# Altium project 0ALD488.PrjPcb
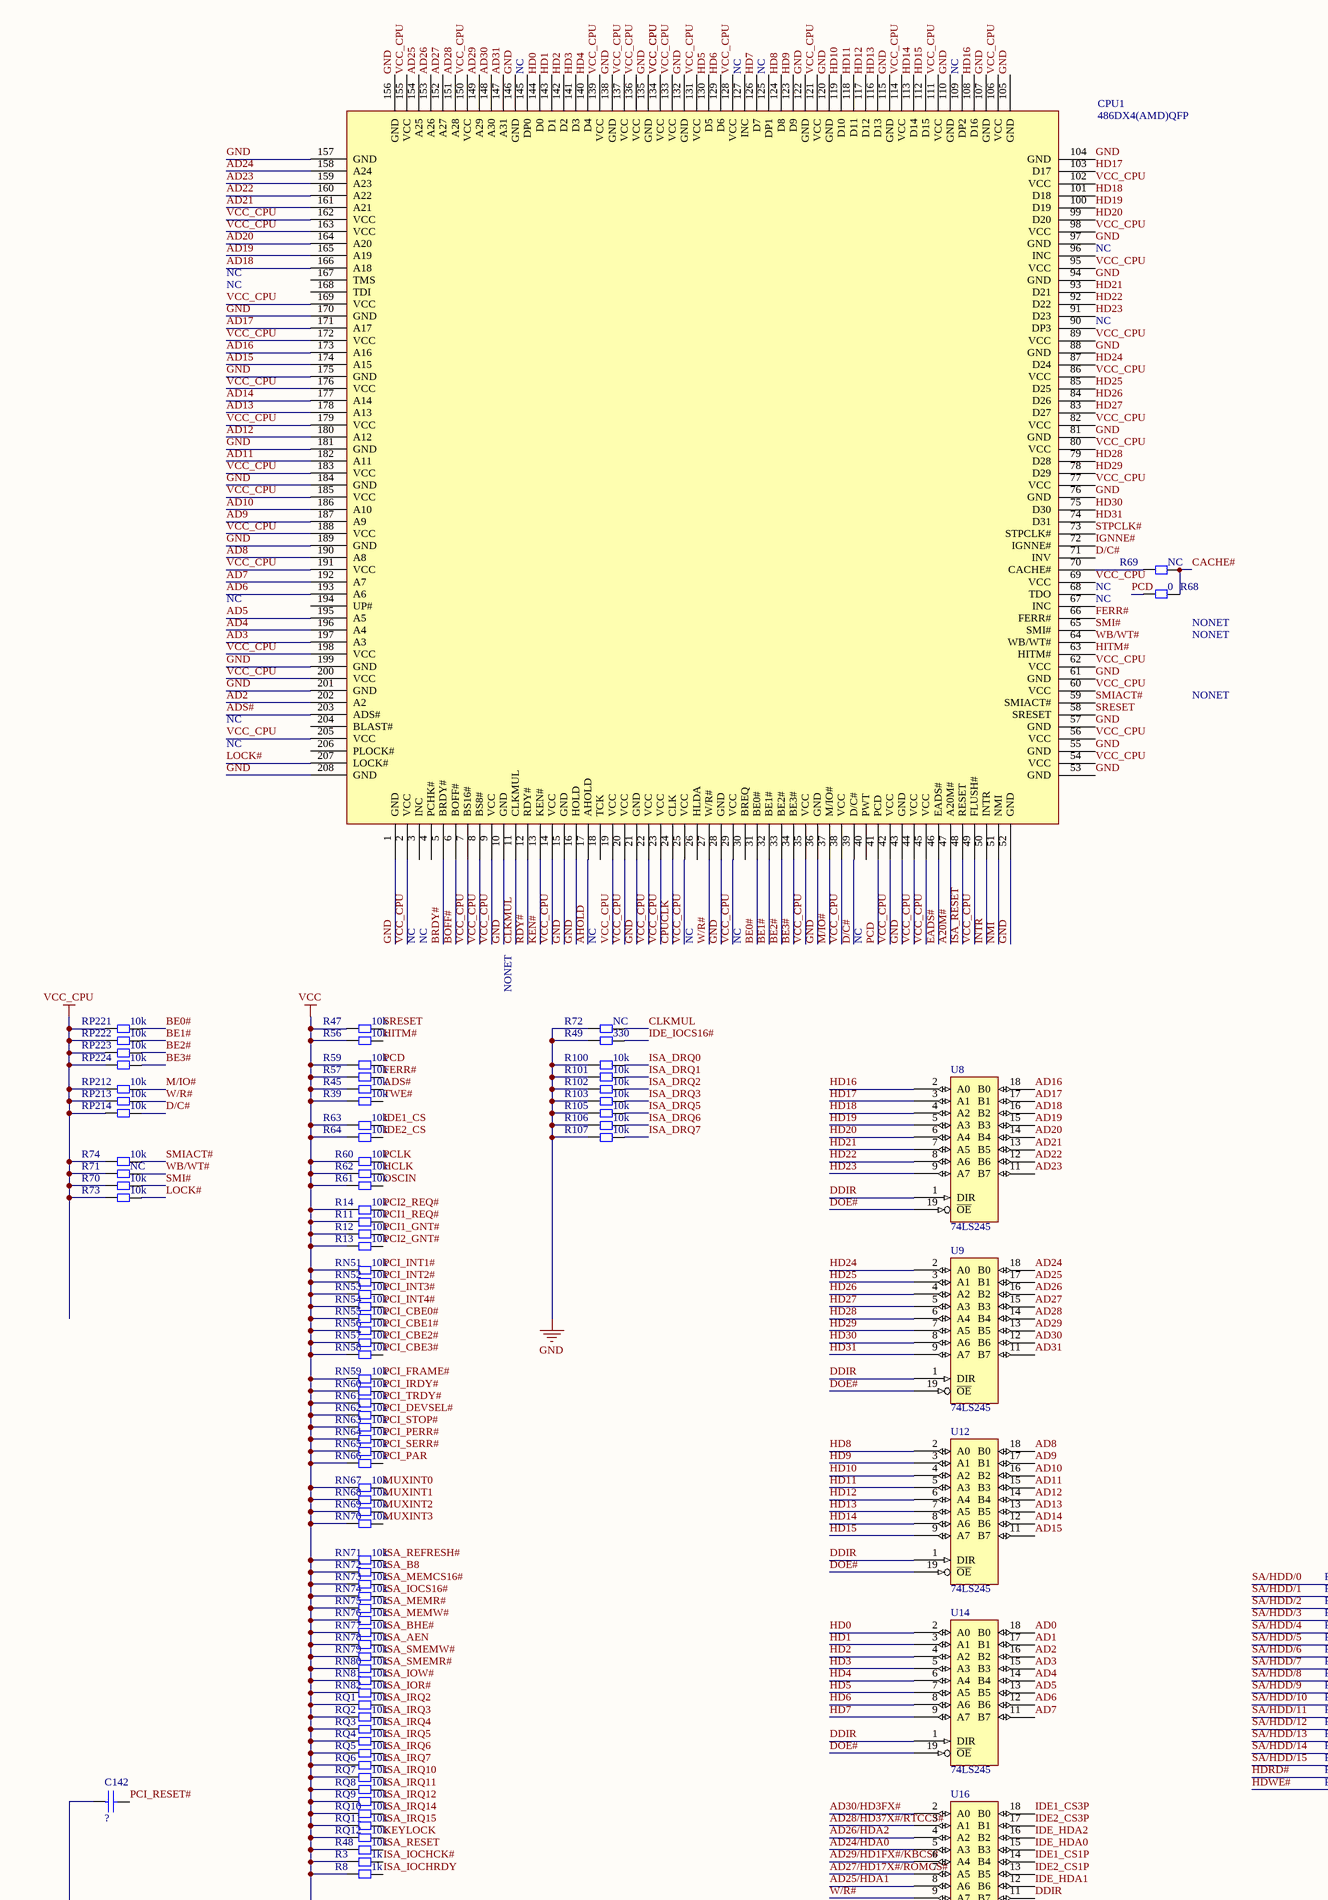
[diagram p0: Sheet1.SchDoc, top left]
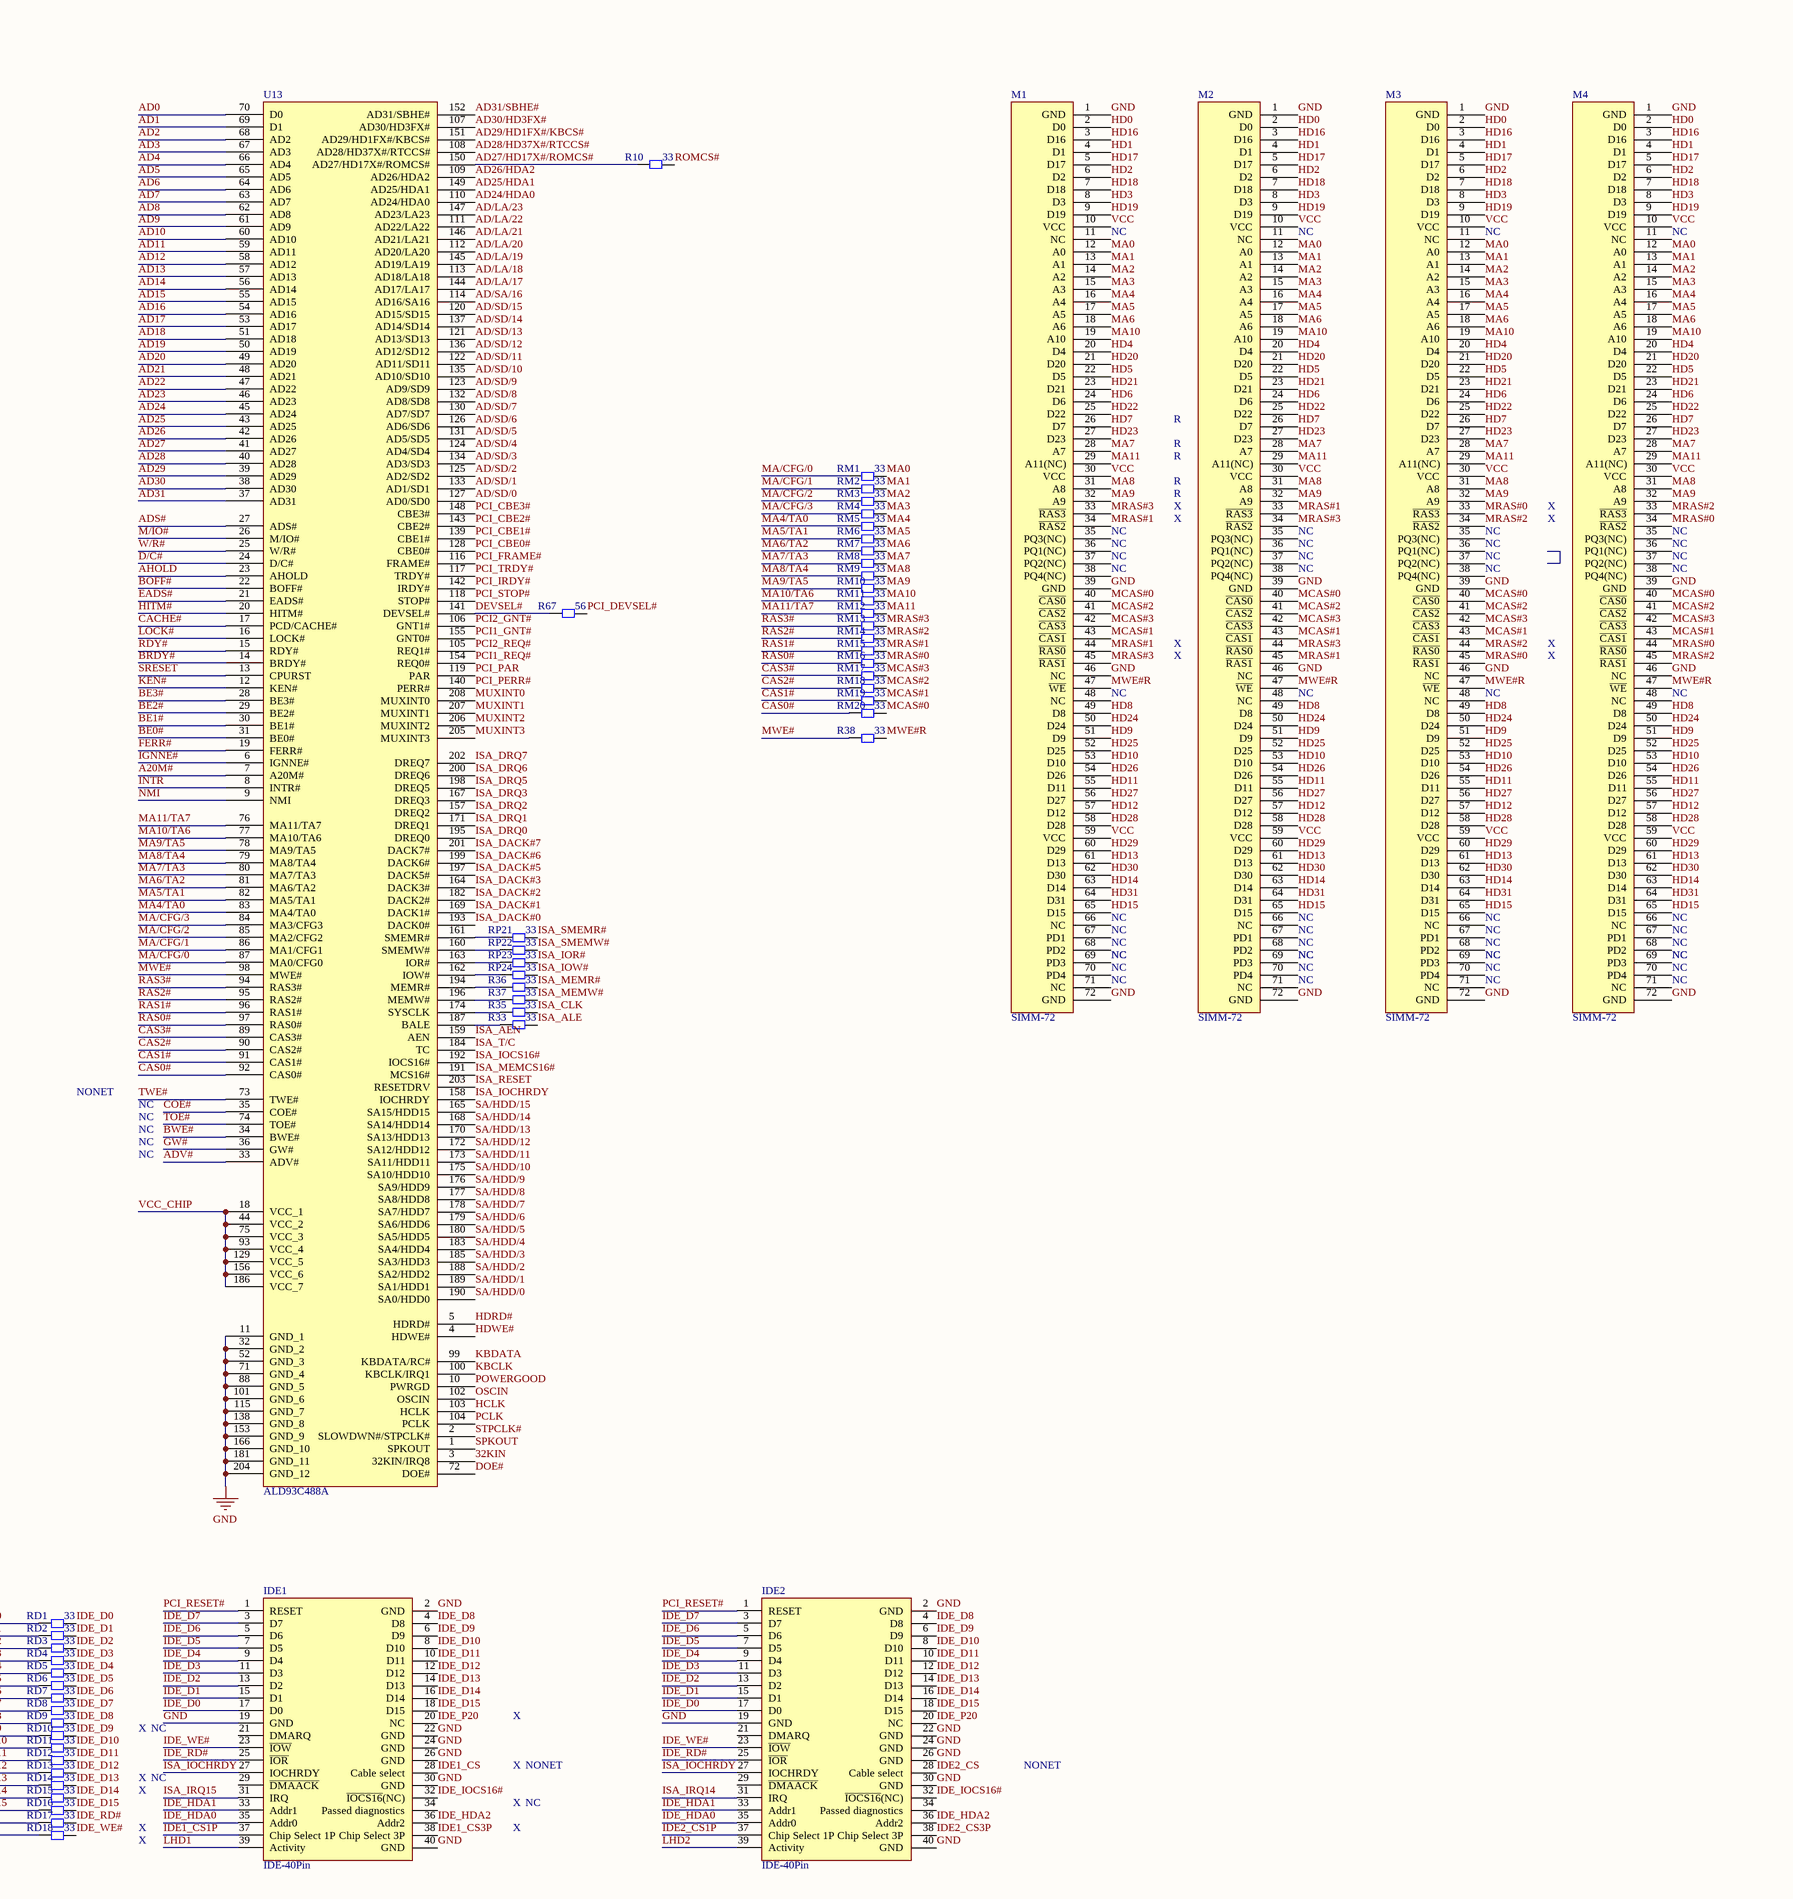
[diagram p1: Sheet1.SchDoc, top middle]
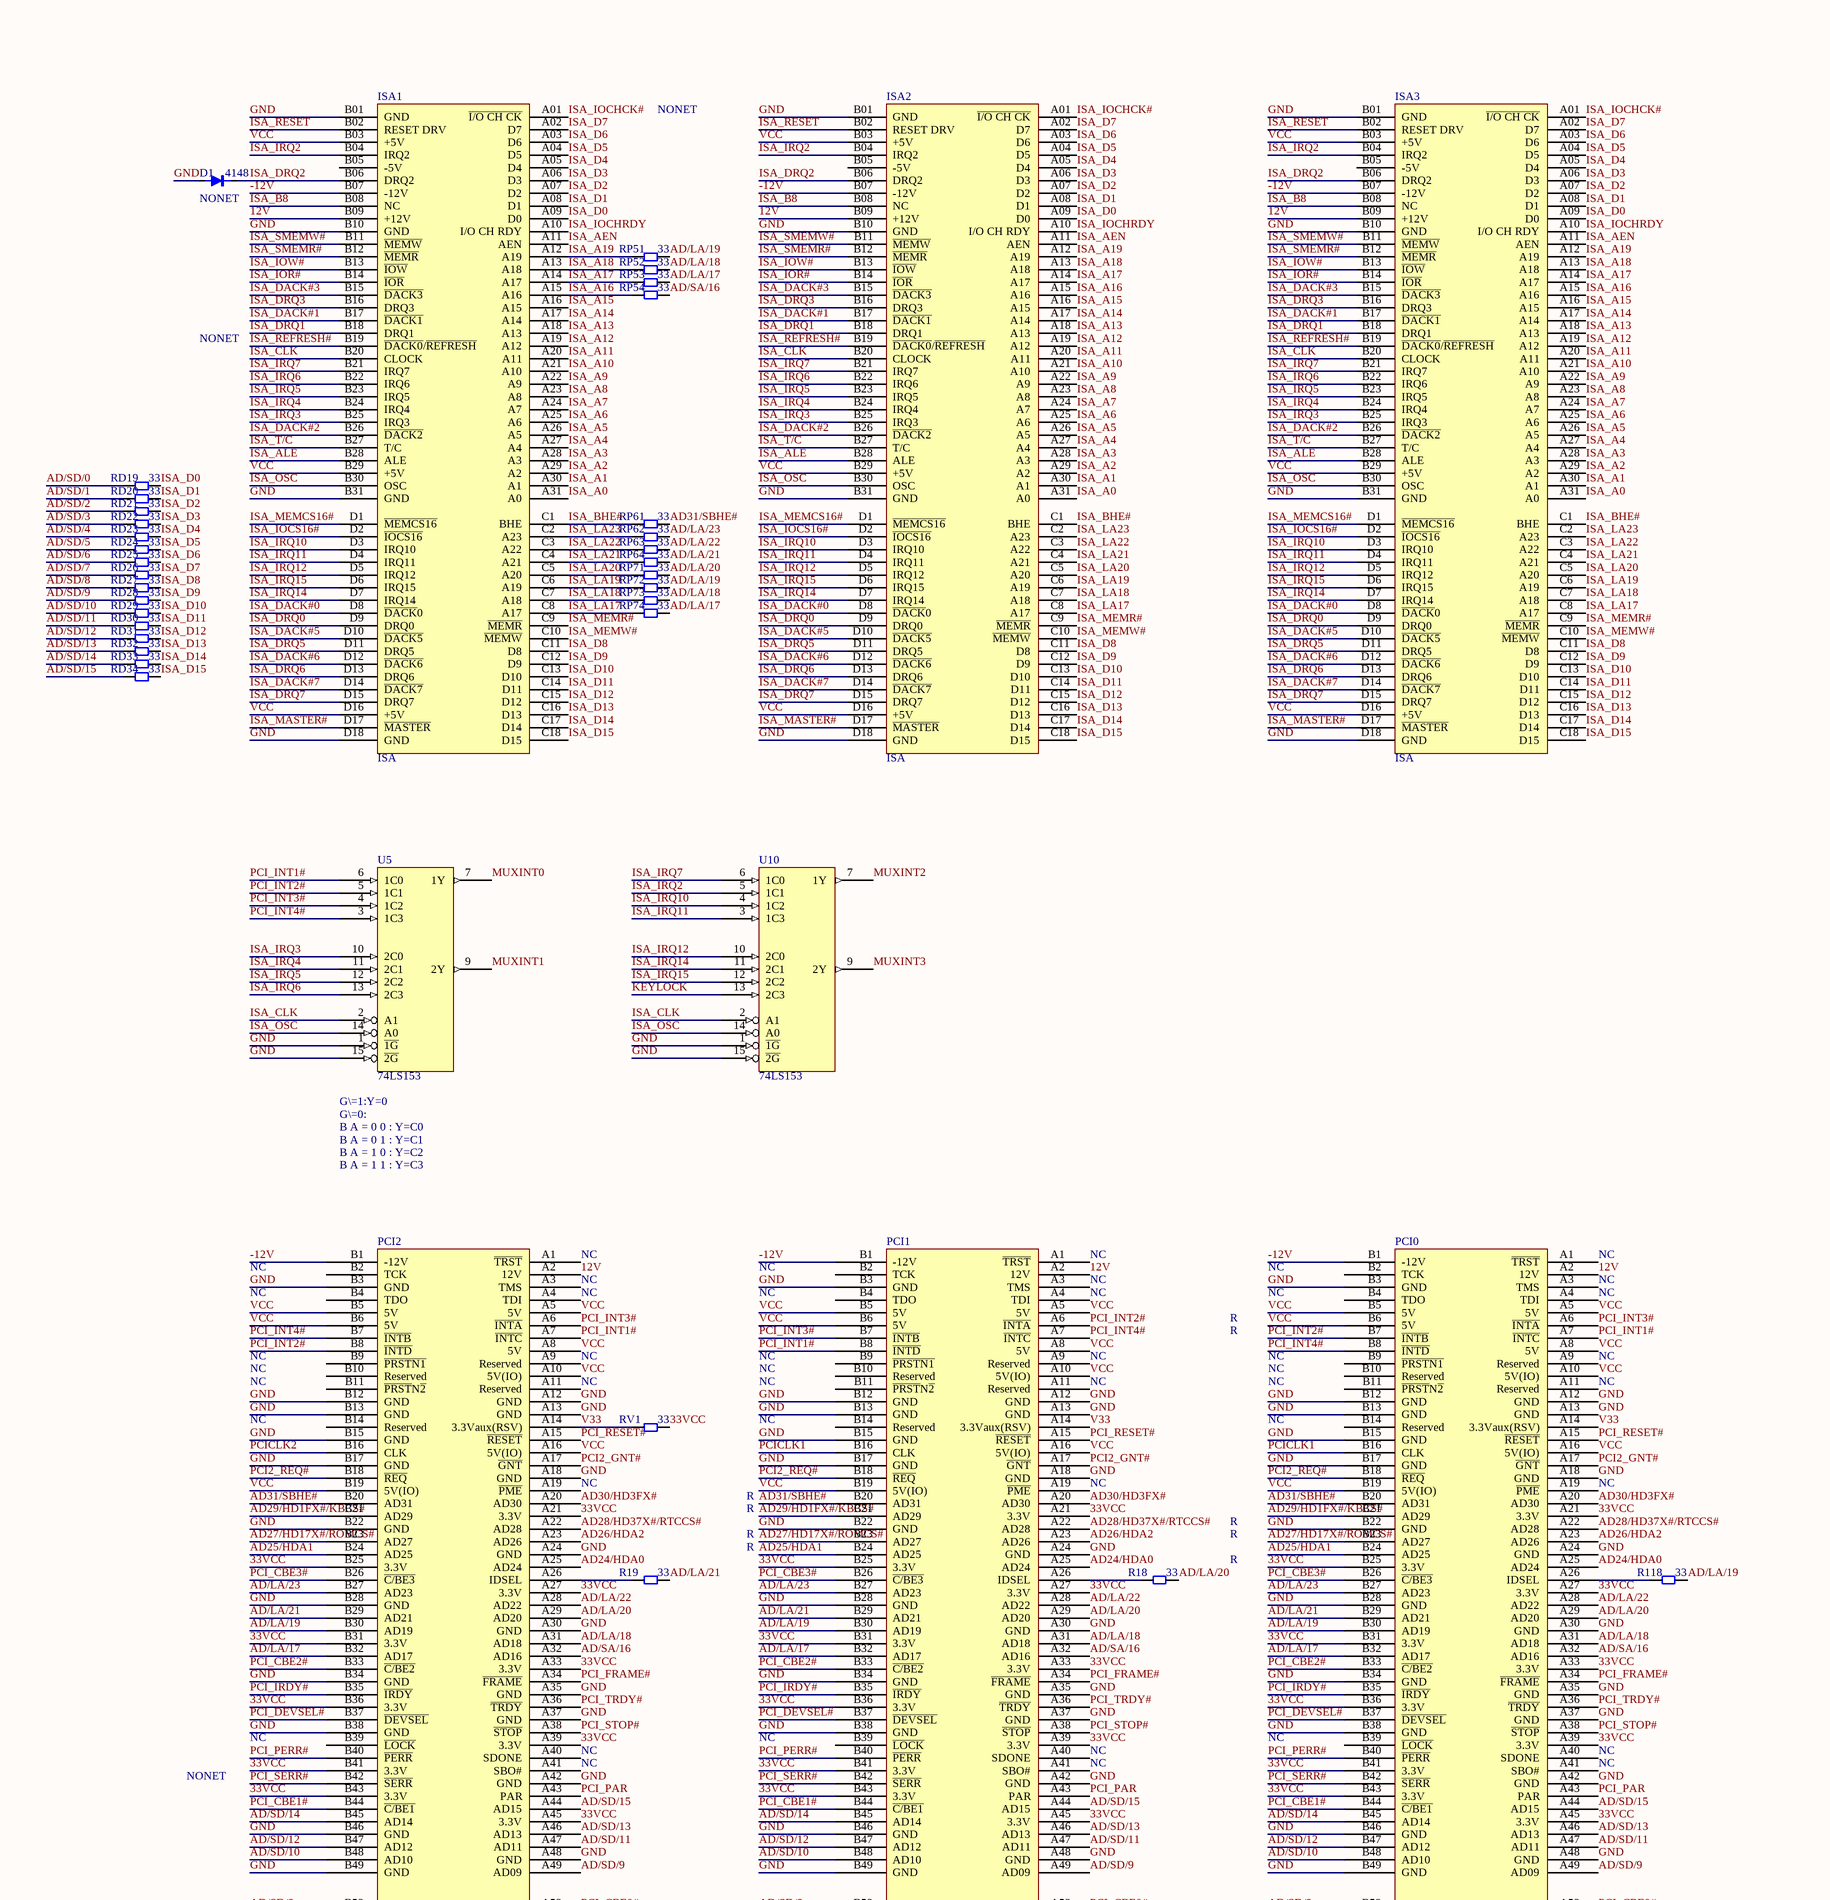
[diagram p2: Sheet1.SchDoc, top right]
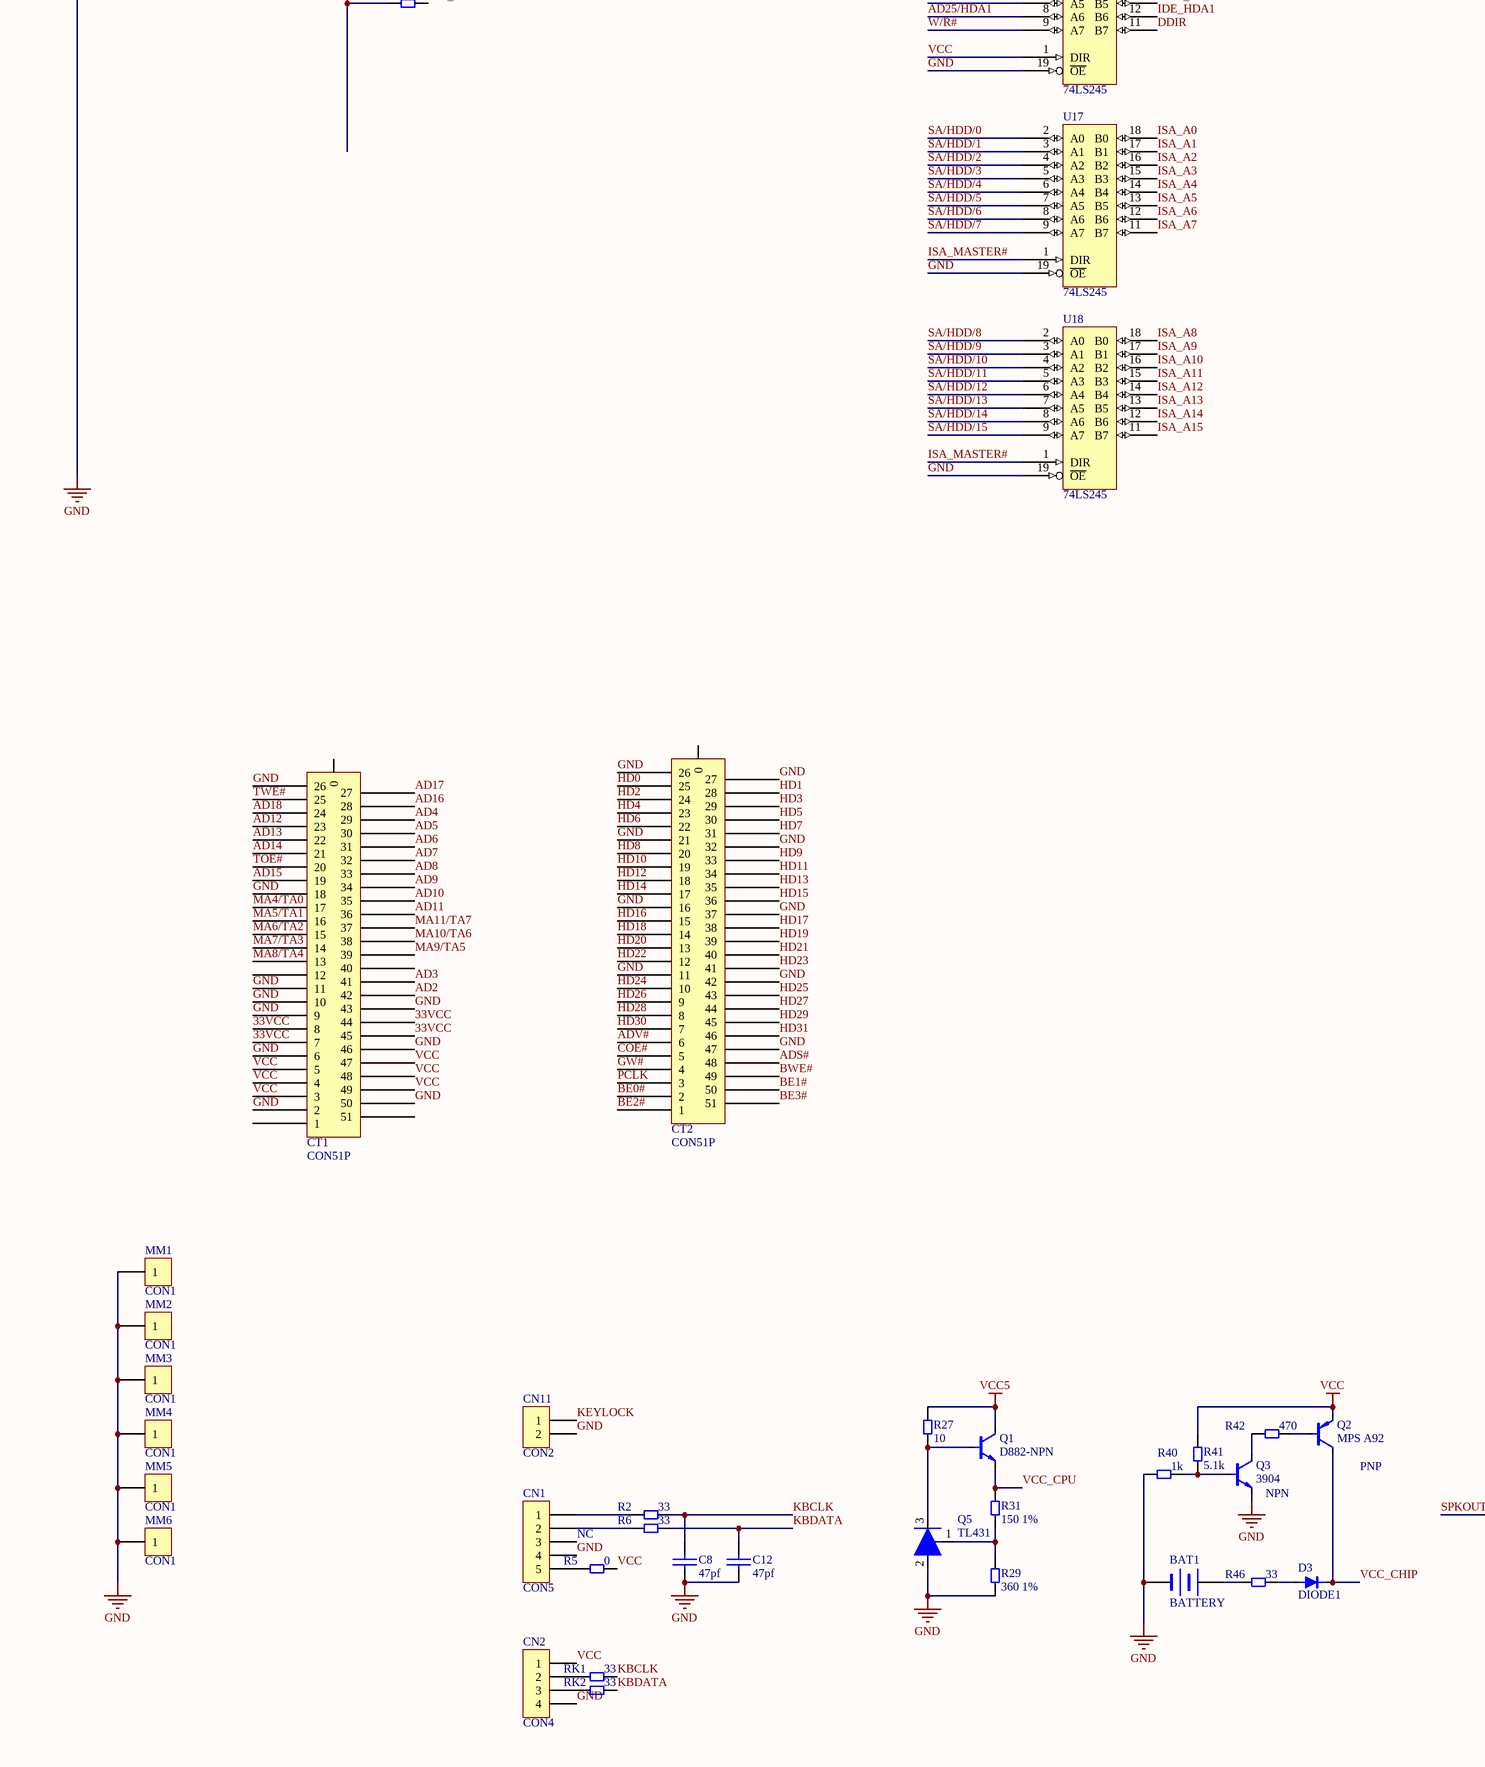
[diagram p3: Sheet1.SchDoc, bottom left]
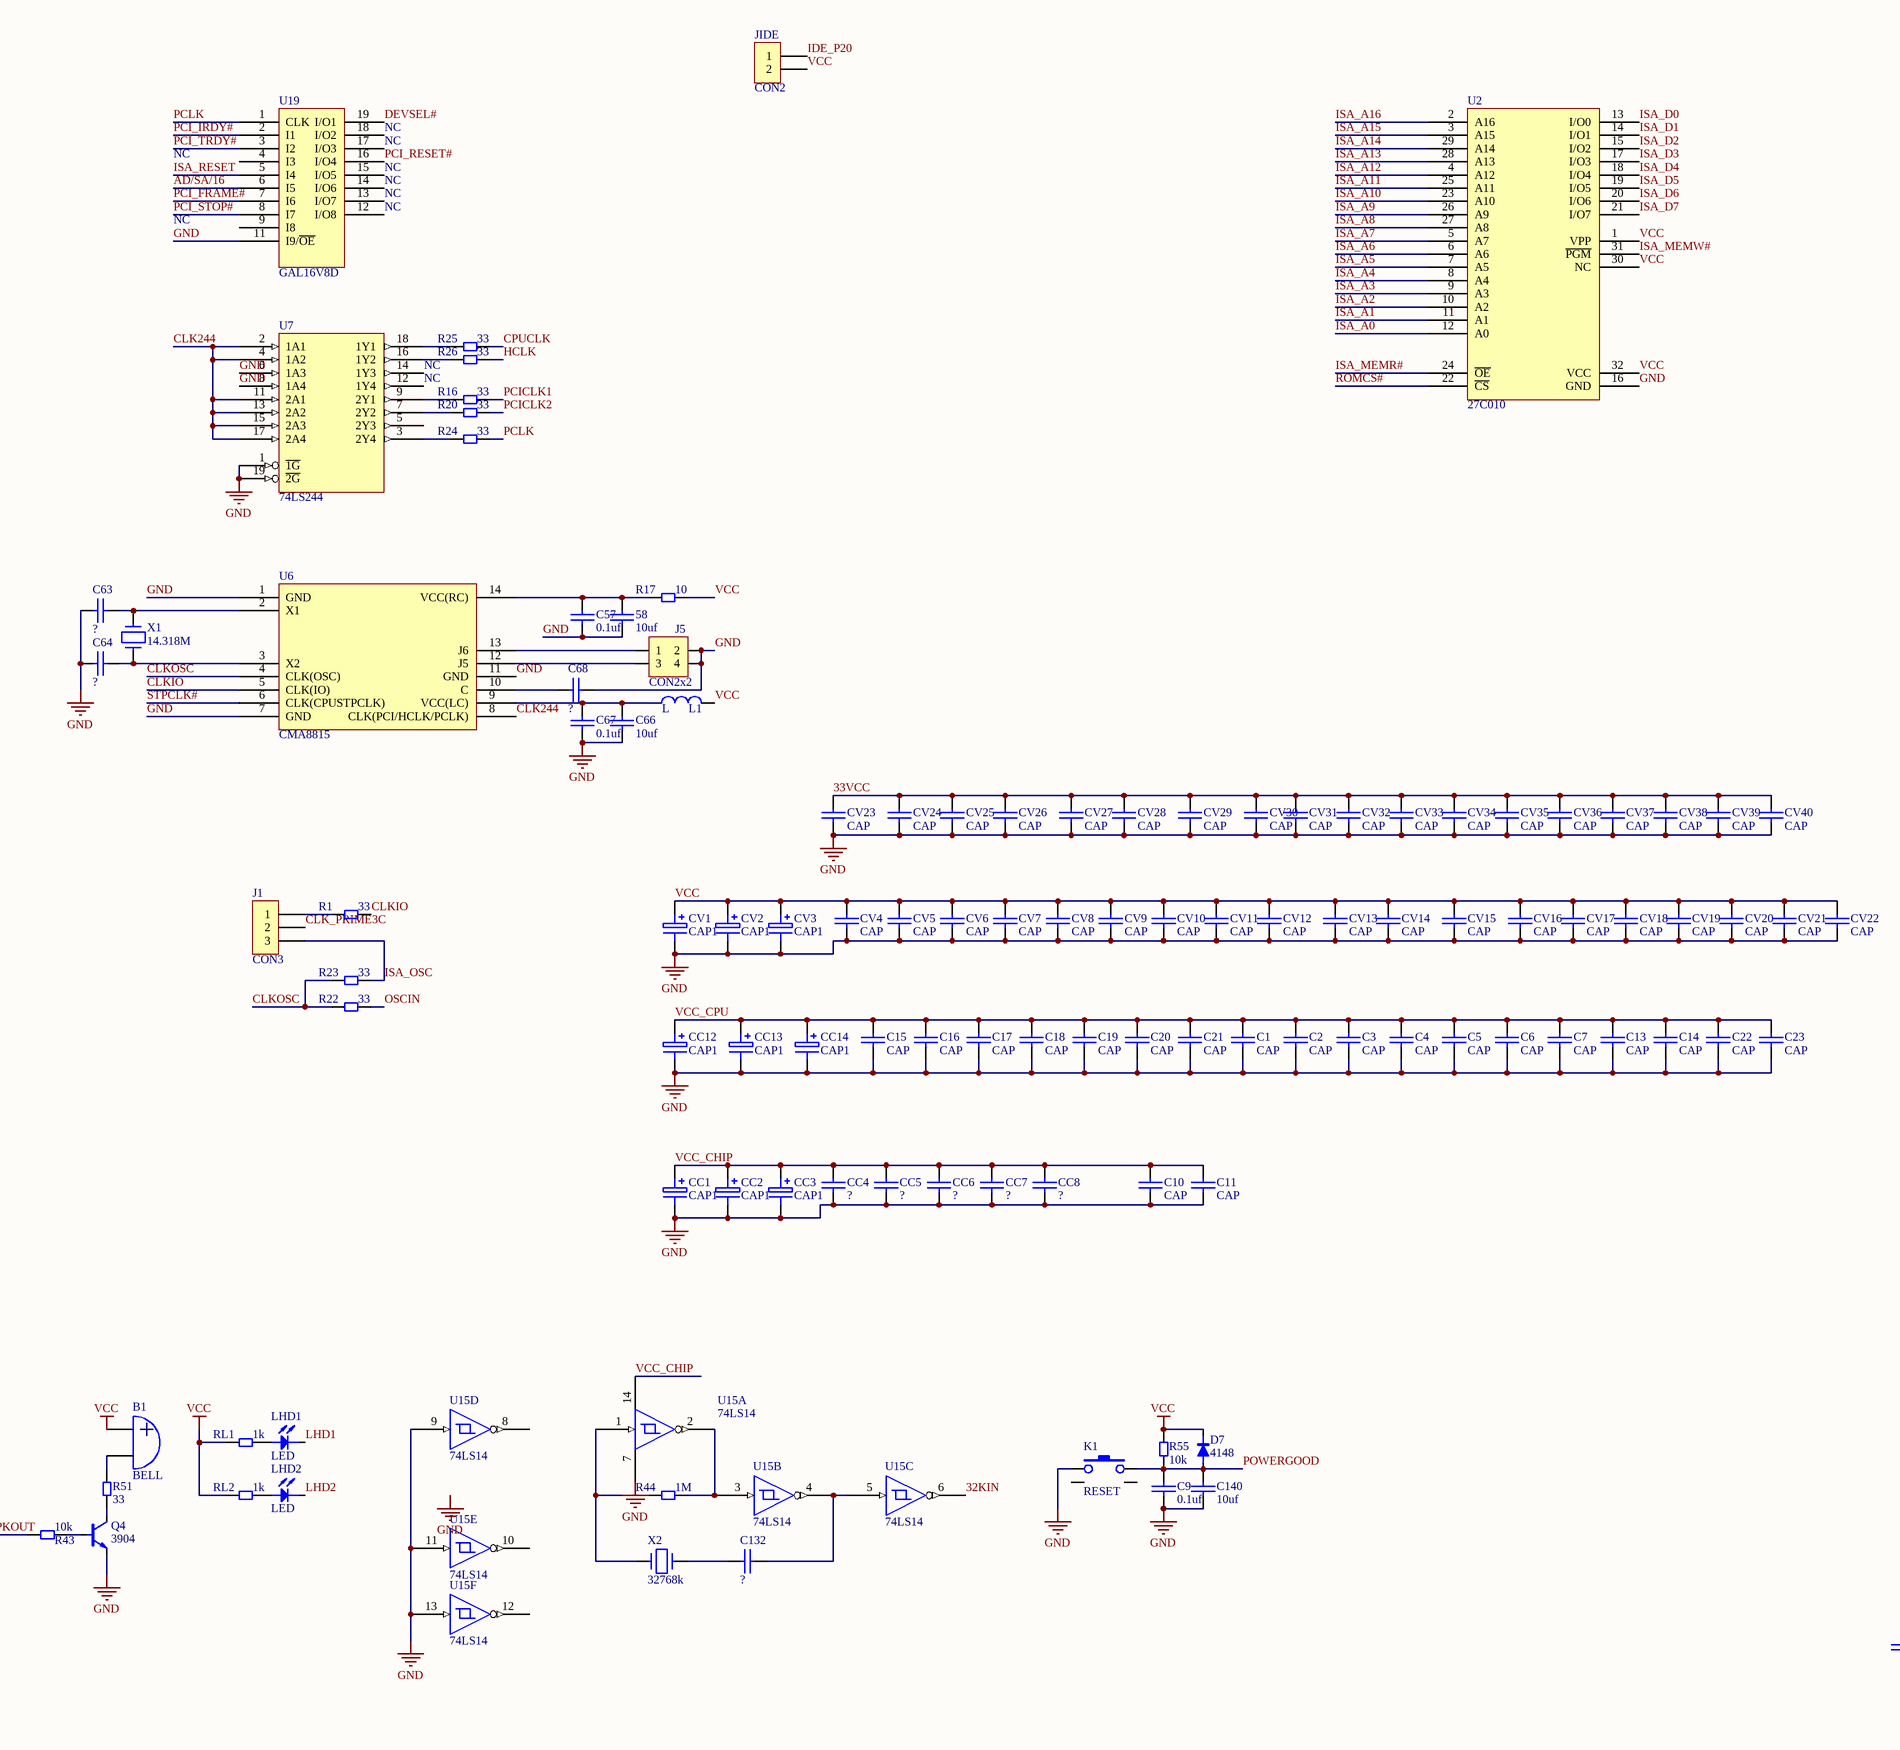
[diagram p4: Sheet1.SchDoc, bottom middle]
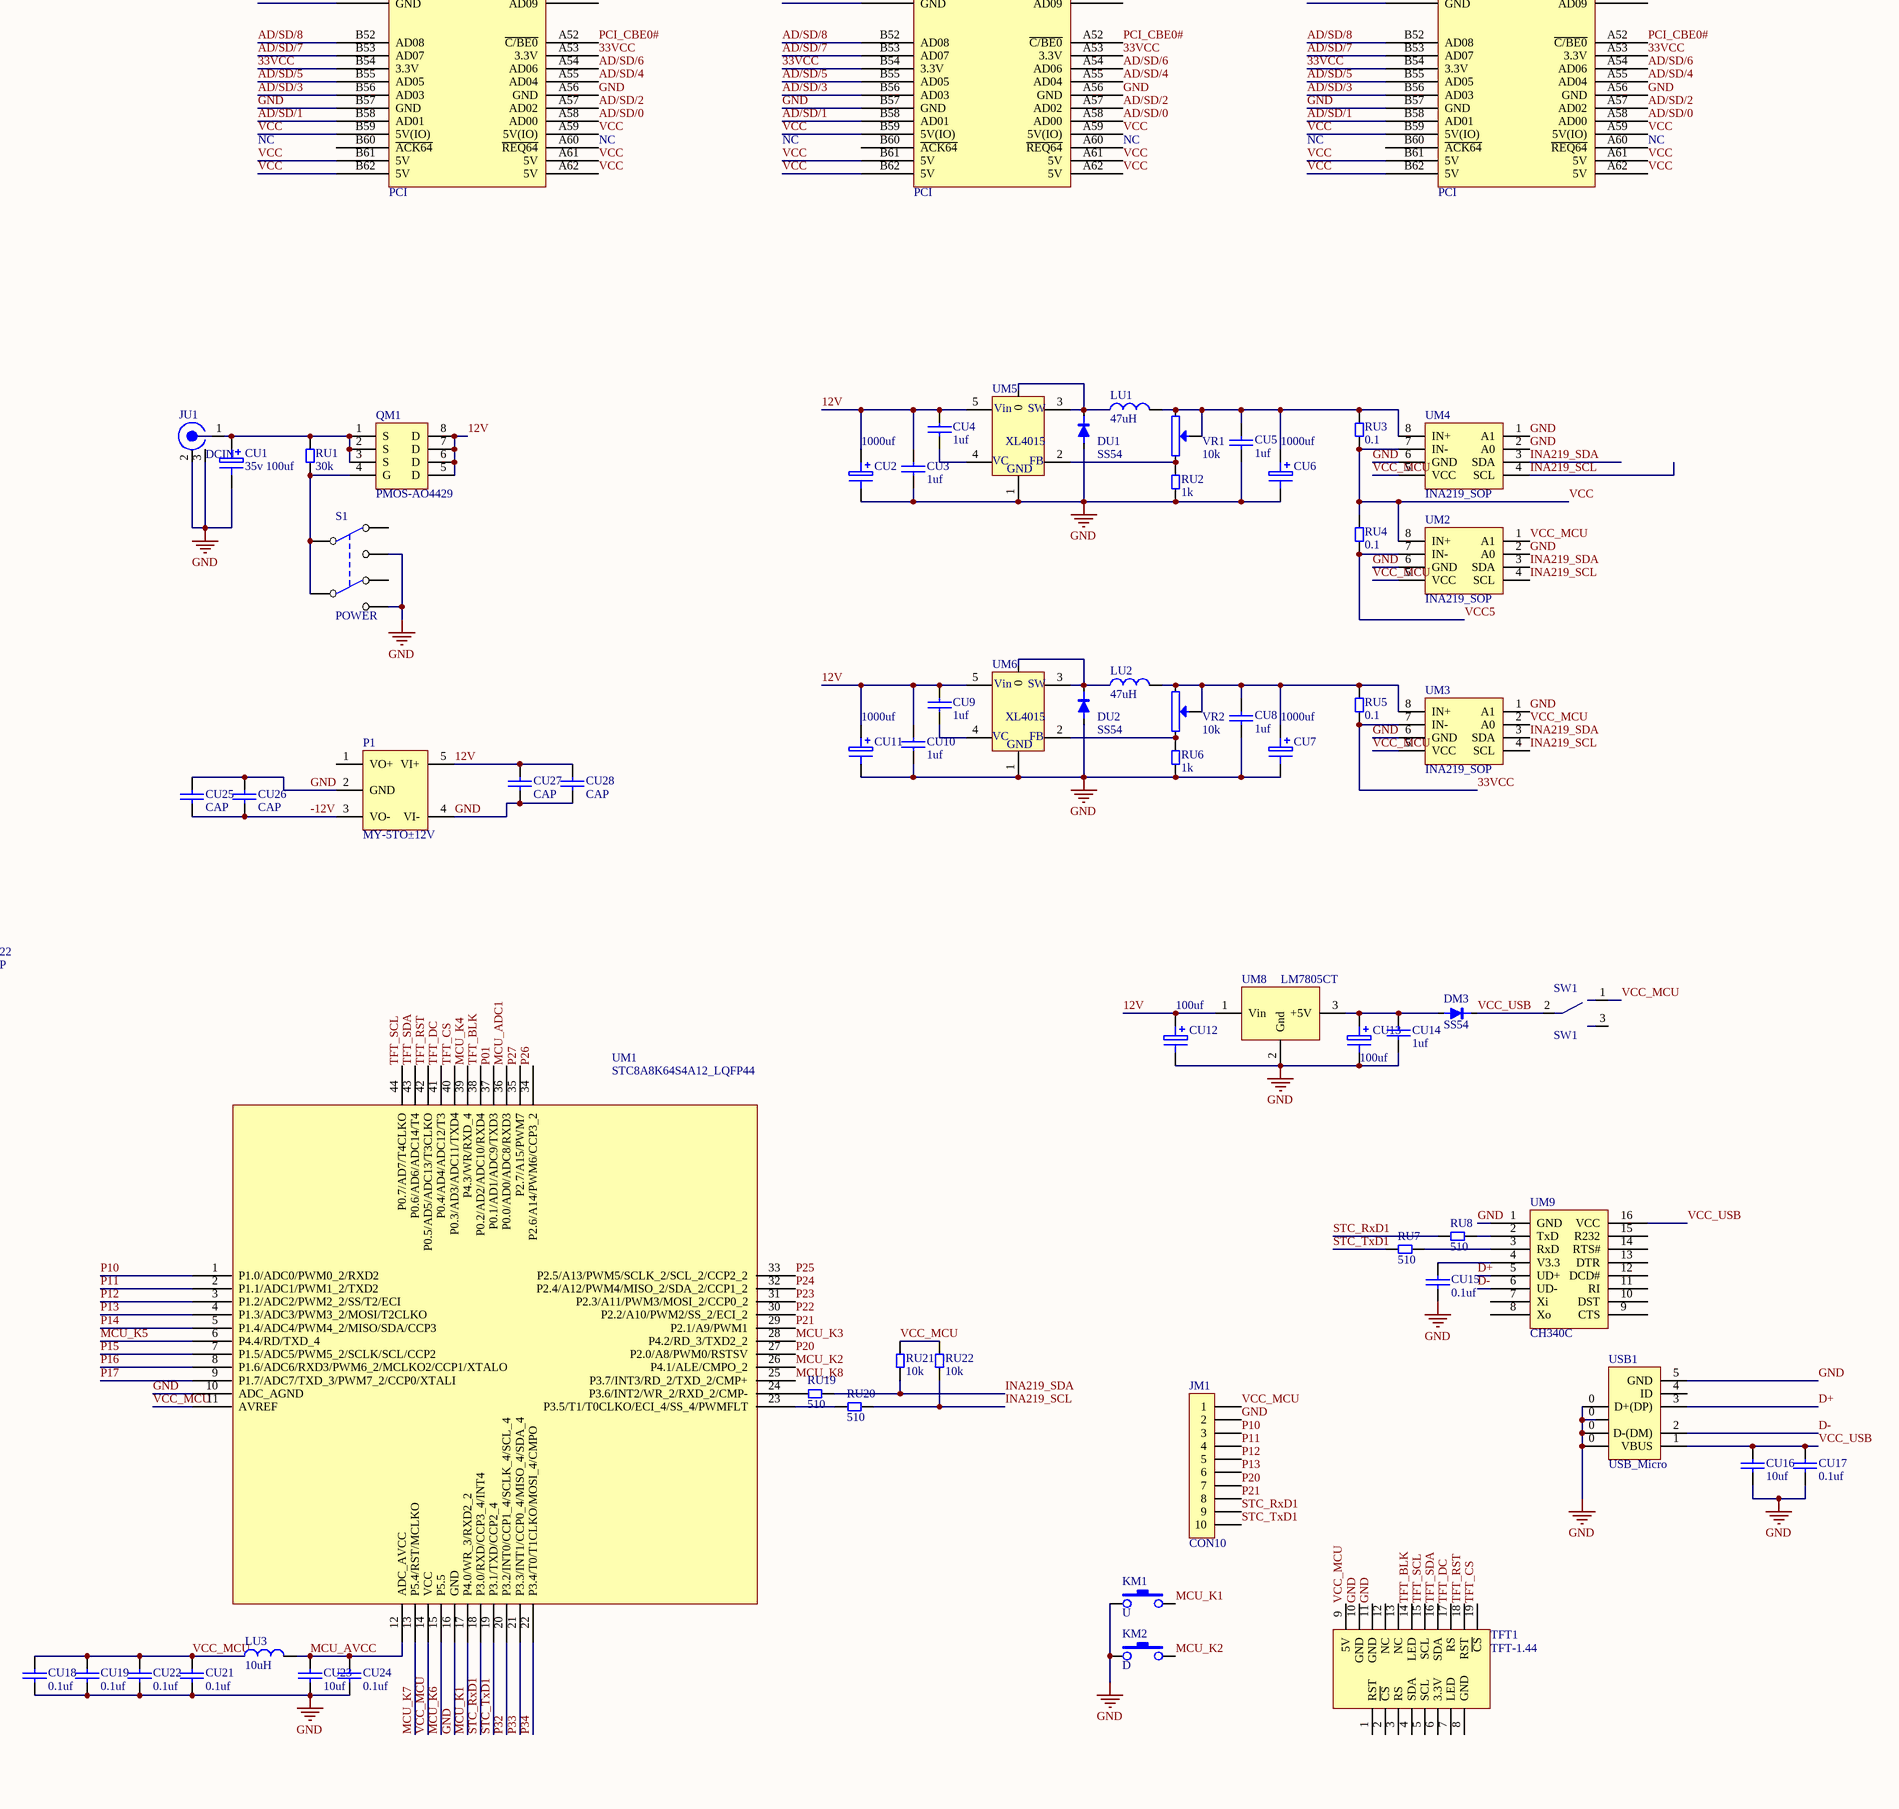
[diagram p5: Sheet1.SchDoc, bottom right]
1 sheet, 399 parts. Net scope: global (net labels, ports and power ports of the same name join across sheets).
Board file: PCB1.PcbDoc

## Sheet Sheet1.SchDoc
size 1016 x 762 mm; SheetNumber: 1; SheetTotal: 1

### Parts
58  10uf  [C0603]
B1  BELL  [bell]
BAT1  BATTERY  [BATTERY3]
C1  CAP  [C0603]
C2  CAP  [C0603]
C3  CAP  [C0603]
C4  CAP  [C0603]
C5  CAP  [C0603]
C6  CAP  [C0603]
C7  CAP  [C0603]
C8  47pf  [C0603]
C9  0.1uf  [C0603]
C10  CAP  [C0603]
C11  CAP  [C0603]
C12  47pf  [C0603]
C13  CAP  [C0603]
C14  CAP  [C0603]
C15  CAP  [C0603]
C16  CAP  [C0603]
C17  CAP  [C0603]
C18  CAP  [C0603]
C19  CAP  [C0603]
C20  CAP  [C0603]
C21  CAP  [C0603]
C22  CAP  [C0603]
C23  CAP  [C0603]
C57  0.1uf  [C0603]
C63  ?  [C0603]
C64  ?  [C0603]
C66  10uf  [C0603]
C67  0.1uf  [C0603]
C68  ?  [C0603]
C132  ?  [C0603]
C140  10uf  [C0603]
C142  ?  [C0603]
CC1  CAP1  [RB.1/.2]
CC2  CAP1  [RB.1/.2]
CC3  CAP1  [RB.1/.2]
CC4  ?  [C0603]
CC5  ?  [C0603]
CC6  ?  [C0603]
CC7  ?  [C0603]
CC8  ?  [C0603]
CC12  CAP1  [RB.1/.2]
CC13  CAP1  [RB.1/.2]
CC14  CAP1  [RB.1/.2]
CN1  CON5  [PS2-XT-5]
CN2  CON4  [XH2.54-4]
CN11  CON2  [SIP2]
CPU1  486DX4(AMD)QFP  [QFP208]
CT1  CON51P  [BTB1.0-51P]
CT2  CON51P  [BTB1.0-51P]
CU1  35v 100uf  [CD6]
CU2  1000uf  [SMD-EC-F10]
CU3  1uf  [C0603]
CU4  1uf  [C0603]
CU5  1uf  [C0603]
CU6  1000uf  [SMD-EC-F10]
CU7  1000uf  [SMD-EC-F10]
CU8  1uf  [C0603]
CU9  1uf  [C0603]
CU10  1uf  [C0603]
CU11  1000uf  [SMD-EC-F10]
CU12  100uf  [SMD-EC-F6.3]
CU13  100uf  [SMD-EC-F6.3]
CU14  1uf  [C0603]
CU15  0.1uf  [C0603]
CU16  10uf  [C0603]
CU17  0.1uf  [C0603]
CU18  0.1uf  [C0603]
CU19  0.1uf  [C0603]
CU21  0.1uf  [C0603]
CU22  0.1uf  [C0603]
CU23  10uf  [C0603]
CU24  0.1uf  [C0603]
CU25  CAP  [C0603]
CU26  CAP  [C0603]
CU27  CAP  [C0603]
CU28  CAP  [C0603]
CV1  CAP1  [RB.1/.2]
CV2  CAP1  [RB.1/.2]
CV3  CAP1  [RB.1/.2]
CV4  CAP  [C0603]
CV5  CAP  [C0603]
CV6  CAP  [C0603]
CV7  CAP  [C0603]
CV8  CAP  [C0603]
CV9  CAP  [C0603]
CV10  CAP  [C0603]
CV11  CAP  [C0603]
CV12  CAP  [C0603]
CV13  CAP  [C0603]
CV14  CAP  [C0603]
CV15  CAP  [C0603]
CV16  CAP  [C0603]
CV17  CAP  [C0603]
CV18  CAP  [C0603]
CV19  CAP  [C0603]
CV20  CAP  [C0603]
CV21  CAP  [C0603]
CV22  CAP  [C0603]
CV23  CAP  [C0603]
CV24  CAP  [C0603]
CV25  CAP  [C0603]
CV26  CAP  [C0603]
CV27  CAP  [C0603]
CV28  CAP  [C0603]
CV29  CAP  [C0603]
CV30  CAP  [C0603]
CV31  CAP  [C0603]
CV32  CAP  [C0603]
CV33  CAP  [C0603]
CV34  CAP  [C0603]
CV35  CAP  [C0603]
CV36  CAP  [C0603]
CV37  CAP  [C0603]
CV38  CAP  [C0603]
CV39  CAP  [C0603]
CV40  CAP  [C0603]
D1  4148  [DO-214A(SMA)]
D3  DIODE1  [DO-214A(SMA)]
D7  4148  [DO-214A(SMA)]
DM3  SS54  [DO-214A(SMA)]
DU1  SS54  [DO-214A(SMA)]
DU2  SS54  [DO-214A(SMA)]
IDE1  IDE-40Pin  [MY-IDE40]
IDE2  IDE-40Pin  [MY-IDE40]
ISA1  ISA  [MY-ISA16-98]
ISA2  ISA  [MY-ISA16-98]
ISA3  ISA  [MY-ISA16-98]
J1  CON3  [SIP3]
J5  CON2x2  [SIP2x2(2.54)]
JIDE  CON2  [SIP2]
JM1  CON10  [sip10]
JU1  DCIN  [DC5.5-2.5]
K1  RESET  [AN66]
KM1  U  [AN66]
KM2  D  [AN66]
L1  L  [L0603]
LHD1  LED  [LED0603]
LHD2  LED  [LED0603]
LU1  47uH  [L1260]
LU2  47uH  [L1260]
LU3  10uH  [L0805]
M1  SIMM-72  [MY-SIMM72]
M2  SIMM-72  [MY-SIMM72]
M3  SIMM-72  [MY-SIMM72]
M4  SIMM-72  [MY-SIMM72]
MM1  CON1  [M3]
MM2  CON1  [M3]
MM3  CON1  [M3]
MM4  CON1  [M3]
MM5  CON1  [M3]
MM6  CON1  [M3]
P1  MY-5TO±12V  [MY-5TO±12]
PCI0  PCI  [PCI]
PCI1  PCI  [PCI]
PCI2  PCI  [PCI]
Q1  D882-NPN  [TO-126A]
Q2  MPS A92  [TO-92]
Q3  3904  [SOT23]
Q4  3904  [SOT23]
Q5  TL431  [TO92]
QM1  PMOS-AO4429  [SO-8]
R1  33  [R0603]
R2  33  [R0603]
R3  1k  [R0603]
R5  0  [R0603]
R6  33  [R0603]
R8  1k  [R0603]
R10  33  [R0603]
R11  10k  [R0603]
R12  10k  [R0603]
R13  10k  [R0603]
R14  10k  [R0603]
R16  33  [R0603]
R17  10  [R0603]
R18  33  [R0603]
R19  33  [R0603]
R20  33  [R0603]
R22  33  [R0603]
R23  33  [R0603]
R24  33  [R0603]
R25  33  [R0603]
R26  33  [R0603]
R27  10  [R0603]
R29  360 1%  [R0603]
R31  150 1%  [R0603]
R33  33  [R0603]
R35  33  [R0603]
R36  33  [R0603]
R37  33  [R0603]
R38  33  [R0603]
R39  10k  [R0603]
R40  1k  [R0603]
R41  5.1k  [R0603]
R42  470  [R0603]
R43  10k  [R0603]
R44  1M  [R0603]
R45  10k  [R0603]
R46  33  [R0603]
R47  10k  [R0603]
R48  10k  [R0603]
R49  330  [R0603]
R51  33  [R0603]
R55  10k  [R0603]
R56  10k  [R0603]
R57  10k  [R0603]
R59  10k  [R0603]
R60  10k  [R0603]
R61  10k  [R0603]
R62  10k  [R0603]
R63  10k  [R0603]
R64  10k  [R0603]
R67  56  [R0603]
R68  0  [R0603]
R69  NC  [R0603]
R70  10k  [R0603]
R71  NC  [R0603]
R72  NC  [R0603]
R73  10k  [R0603]
R74  10k  [R0603]
R100  10k  [R0603]
R101  10k  [R0603]
R102  10k  [R0603]
R103  10k  [R0603]
R105  10k  [R0603]
R106  10k  [R0603]
R107  10k  [R0603]
R118  33  [R0603]
RD1  33  [R0603]
RD2  33  [R0603]
RD3  33  [R0603]
RD4  33  [R0603]
RD5  33  [R0603]
RD6  33  [R0603]
RD7  33  [R0603]
RD8  33  [R0603]
RD9  33  [R0603]
RD10  33  [R0603]
RD11  33  [R0603]
RD12  33  [R0603]
RD13  33  [R0603]
RD14  33  [R0603]
RD15  33  [R0603]
RD16  33  [R0603]
RD17  33  [R0603]
RD18  33  [R0603]
RD19  33  [R0603]
RD20  33  [R0603]
RD21  33  [R0603]
RD22  33  [R0603]
RD23  33  [R0603]
RD24  33  [R0603]
RD25  33  [R0603]
RD26  33  [R0603]
RD27  33  [R0603]
RD28  33  [R0603]
RD29  33  [R0603]
RD30  33  [R0603]
RD31  33  [R0603]
RD32  33  [R0603]
RD33  33  [R0603]
RD34  33  [R0603]
RK1  33  [R0603]
RK2  33  [R0603]
RL1  1k  [R0603]
RL2  1k  [R0603]
RM1  33  [R0603]
RM2  33  [R0603]
RM3  33  [R0603]
RM4  33  [R0603]
RM5  33  [R0603]
RM6  33  [R0603]
RM7  33  [R0603]
RM8  33  [R0603]
RM9  33  [R0603]
RM10  33  [R0603]
RM11  33  [R0603]
RM12  33  [R0603]
RM13  33  [R0603]
RM14  33  [R0603]
RM15  33  [R0603]
RM16  33  [R0603]
RM17  33  [R0603]
RM18  33  [R0603]
RM19  33  [R0603]
RM20  33  [R0603]
RN51  10k  [R0603]
RN52  10k  [R0603]
RN53  10k  [R0603]
RN54  10k  [R0603]
RN55  10k  [R0603]
RN56  10k  [R0603]
RN57  10k  [R0603]
RN58  10k  [R0603]
RN59  10k  [R0603]
RN60  10k  [R0603]
RN61  10k  [R0603]
RN62  10k  [R0603]
RN63  10k  [R0603]
RN64  10k  [R0603]
RN65  10k  [R0603]
RN66  10k  [R0603]
RN67  10k  [R0603]
RN68  10k  [R0603]
RN69  10k  [R0603]
RN70  10k  [R0603]
RN71  10k  [R0603]
RN72  10k  [R0603]
RN73  10k  [R0603]
RN74  10k  [R0603]
RN75  10k  [R0603]
RN76  10k  [R0603]
RN77  10k  [R0603]
RN78  10k  [R0603]
RN79  10k  [R0603]
RN80  10k  [R0603]
RN81  10k  [R0603]
RN82  10k  [R0603]
RP21  33  [R0603]
RP22  33  [R0603]
RP23  33  [R0603]
RP24  33  [R0603]
RP51  33  [R0603]
RP52  33  [R0603]
RP53  33  [R0603]
RP54  33  [R0603]
RP61  33  [R0603]
RP62  33  [R0603]
RP63  33  [R0603]
RP64  33  [R0603]
RP71  33  [R0603]
RP72  33  [R0603]
RP73  33  [R0603]
RP74  33  [R0603]
RP212  10k  [R0603]
RP213  10k  [R0603]
RP214  10k  [R0603]
RP221  10k  [R0603]
RP222  10k  [R0603]
RP223  10k  [R0603]
RP224  10k  [R0603]
RQ1  10k  [R0603]
RQ2  10k  [R0603]
RQ3  10k  [R0603]
RQ4  10k  [R0603]
RQ5  10k  [R0603]
RQ6  10k  [R0603]
RQ7  10k  [R0603]
RQ8  10k  [R0603]
RQ9  10k  [R0603]
RQ10  10k  [R0603]
RQ11  10k  [R0603]
RQ12  10k  [R0603]
RU1  30k  [R0603]
RU2  1k  [R0603]
RU3  0.1  [2512]
RU4  0.1  [2512]
RU5  0.1  [2512]
RU6  1k  [R0603]
RU7  510  [R0603]
RU8  510  [R0603]
RU19  510  [R0603]
RU20  510  [R0603]
RU21  10k  [R0603]
RU22  10k  [R0603]
RV1  33  [R0603]
S1  POWER  [SW 8x8]
SW1  SW1  [SW1]
TFT1  TFT-1.44  [MY-1.44TFT]
U2  27C010  [ZIF32]
U5  74LS153  [DIP-16]
U6  CMA8815  [DIP14]
U7  74LS244  [DIP20]
U8  74LS245  [SOP20]
U9  74LS245  [SOP20]
U10  74LS153  [DIP-16]
U12  74LS245  [SOP20]
U13  ALD93C488A  [QFP208]
U14  74LS245  [SOP20]
U15  74LS14  [SO-14]  (parts A,B,C,D,E,F of 6)
U16  74LS245  [SOP20]
U17  74LS245  [SOP20]
U18  74LS245  [SOP20]
U19  GAL16V8D  [DIP20]
UM1  STC8A8K64S4A12_LQFP44  [LQFP44]
UM2  INA219_SOP  [SO-8]
UM3  INA219_SOP  [SO-8]
UM4  INA219_SOP  [SO-8]
UM5  XL4015  [TO-263(T)]
UM6  XL4015  [TO-263(T)]
UM8  LM7805CT  [TO-252(DPAK)]
UM9  CH340C  [SOP-16]
USB1  USB_Micro  [USB_Micro]
VR1  10k  [3x3P]
VR2  10k  [3x3P]
X1  14.318M  [5032]
X2  32768k  [CRY-26]

### Nets
GND: 58.1 BAT1.2(-) C1.2 C2.2 C3.2 C4.2 C5.2 C6.2 C7.2 C8.1 C9.1 C10.2 C11.2 C12.1 C13.2 C14.2 C15.2 C16.2 C17.2 C18.2 C19.2 C20.2 C21.2 C22.2 C23.2 C57.1 C63.1 C64.1 C66.1 C67.1 C68.2 C140.1 C142.1 CC1.2(E) CC2.2(E) CC3.2(E) CC4.1 CC5.1 CC6.1 CC7.1 CC8.1 CC12.2(E) CC13.2(E) CC14.2(E) CN1.4 CN2.4 CN11.2 CPU1.1(GND) CPU1.10(GND) CPU1.15(GND) CPU1.16(HOLD) CPU1.21(GND) CPU1.28(GND) CPU1.36(GND) CPU1.43(GND) CPU1.52(GND) CPU1.53(GND) CPU1.55(GND) CPU1.57(GND) CPU1.61(GND) CPU1.76(GND) CPU1.81(GND) CPU1.88(GND) CPU1.94(GND) CPU1.97(GND) CPU1.104(GND) CPU1.105(GND) CPU1.107(GND) CPU1.110(GND) CPU1.115(GND) CPU1.120(GND) CPU1.122(GND) CPU1.132(GND) CPU1.135(GND) CPU1.138(GND) CPU1.146(GND) CPU1.156(GND) CPU1.157(GND) CPU1.170(GND) CPU1.175(GND) CPU1.181(GND) CPU1.184(GND) CPU1.189(GND) CPU1.199(GND) CPU1.201(GND) CPU1.208(GND) CT1.2 CT1.6 CT1.9 CT1.10 CT1.11 CT1.18 CT1.26 CT1.43 CT1.46 CT1.50 CT2.11 CT2.16 CT2.21 CT2.26 CT2.27 CT2.32 CT2.37 CT2.42 CT2.47 CU1.2(E) CU2.2(E) CU3.2 CU5.2 CU6.2(E) CU7.2(E) CU8.2 CU10.2 CU11.2(E) CU12.2(E) CU13.2(E) CU14.2 CU15.1 CU16.2 CU17.2 CU18.2 CU19.2 CU21.2 CU22.2 CU23.2 CU24.2 CU25.1 CU26.1 CU27.2 CU28.2 CV1.2(E) CV2.2(E) CV3.2(E) CV4.2 CV5.2 CV6.2 CV7.2 CV8.2 CV9.2 CV10.2 CV11.2 CV12.2 CV13.2 CV14.2 CV15.2 CV16.2 CV17.2 CV18.2 CV19.2 CV20.2 CV21.2 CV22.2 CV23.2 CV24.2 CV25.2 CV26.2 CV27.2 CV28.2 CV29.2 CV30.2 CV31.2 CV32.2 CV33.2 CV34.2 CV35.2 CV36.2 CV37.2 CV38.2 CV39.2 CV40.2 D1.A DU1.A DU2.A IDE1.2(GND) IDE1.19(GND) IDE1.22(GND) IDE1.24(GND) IDE1.26(GND) IDE1.30(GND) IDE1.40(GND) IDE2.2(GND) IDE2.19(GND) IDE2.22(GND) IDE2.24(GND) IDE2.26(GND) IDE2.30(GND) IDE2.40(GND) ISA1.B01(GND) ISA1.B10(GND) ISA1.B31(GND) ISA1.D18(GND) ISA2.B01(GND) ISA2.B10(GND) ISA2.B31(GND) ISA2.D18(GND) ISA3.B01(GND) ISA3.B10(GND) ISA3.B31(GND) ISA3.D18(GND) J5.2 J5.4 JM1.2 JU1.2(-) JU1.3(-) K1.1 KM1.1 KM2.1 M1.1(GND) M1.39(GND) M1.46(NC) M1.72(GND) M2.1(GND) M2.39(GND) M2.46(NC) M2.72(GND) M3.1(GND) M3.39(GND) M3.46(NC) M3.72(GND) M4.1(GND) M4.39(GND) M4.46(NC) M4.72(GND) MM1.1 MM2.1 MM3.1 MM4.1 MM5.1 MM6.1 P1.2(GND) P1.4(VI-) PCI0.A12(GND) PCI0.A13(GND) PCI0.A18(GND) PCI0.A24(GND) PCI0.A30(GND) PCI0.A35(GND) PCI0.A37(GND) PCI0.A42(GND) PCI0.A48(GND) PCI0.A56(GND) PCI0.B3(GND) PCI0.B12(GND) PCI0.B13(GND) PCI0.B15(GND) PCI0.B17(GND) PCI0.B22(GND) PCI0.B28(GND) PCI0.B34(GND) PCI0.B38(GND) PCI0.B46(GND) PCI0.B49(GND) PCI0.B57(GND) PCI1.A12(GND) PCI1.A13(GND) PCI1.A18(GND) PCI1.A24(GND) PCI1.A30(GND) PCI1.A35(GND) PCI1.A37(GND) PCI1.A42(GND) PCI1.A48(GND) PCI1.A56(GND) PCI1.B3(GND) PCI1.B12(GND) PCI1.B13(GND) PCI1.B15(GND) PCI1.B17(GND) PCI1.B22(GND) PCI1.B28(GND) PCI1.B34(GND) PCI1.B38(GND) PCI1.B46(GND) PCI1.B49(GND) PCI1.B57(GND) PCI2.A12(GND) PCI2.A13(GND) PCI2.A18(GND) PCI2.A24(GND) PCI2.A30(GND) PCI2.A35(GND) PCI2.A37(GND) PCI2.A42(GND) PCI2.A48(GND) PCI2.A56(GND) PCI2.B3(GND) PCI2.B12(GND) PCI2.B13(GND) PCI2.B15(GND) PCI2.B17(GND) PCI2.B22(GND) PCI2.B28(GND) PCI2.B34(GND) PCI2.B38(GND) PCI2.B46(GND) PCI2.B49(GND) PCI2.B57(GND) Q3.E(e) Q4.E(e) Q5.2(A) R29.2 R40.2 R49.2 R72.2 R100.2 R101.2 R102.2 R103.2 R105.2 R106.2 R107.2 RU2.2 RU6.2 S1.2(NC1) S1.5(COMMON2) TFT1.10(GND) TFT1.11(GND) U2.16(GND) U5.1(~{1G}) U5.8(GND) U5.15(~{2G}) U6.1(GND) U6.7(GND) U6.11(GND) U7.1(~{1G}) U7.6(1A3) U7.8(1A4) U7.10(GND) U7.19(~{2G}) U8.10(GND) U9.10(GND) U10.1(~{1G}) U10.8(GND) U10.15(~{2G}) U12.10(GND) U13.11(GND_1) U13.32(GND_2) U13.52(GND_3) U13.71(GND_4) U13.88(GND_5) U13.101(GND_6) U13.115(GND_7) U13.138(GND_8) U13.153(GND_9) U13.166(GND_10) U13.181(GND_11) U13.204(GND_12) U14.10(GND) U15.7(GND) U15.9 U15.11 U15.13 U16.10(GND) U16.19(~{OE}) U17.10(GND) U17.19(~{OE}) U18.10(GND) U18.19(~{OE}) U19.10(GND) U19.11(I9/~{OE}) UM1.10(ADC_AGND) UM1.16(GND) UM2.2(A0) UM2.6(GND) UM3.1(A1) UM3.6(GND) UM4.1(A1) UM4.2(A0) UM4.6(GND) UM5.1(GND) UM6.1(GND) UM8.2(Gnd) UM9.1(GND) USB1.0 USB1.5(GND)
VCC: B1.1 CN2.1 CT1.3 CT1.4 CT1.5 CT1.47 CT1.48 CT1.49 CV1.1 CV2.1 CV3.1 CV4.1 CV5.1 CV6.1 CV7.1 CV8.1 CV9.1 CV10.1 CV11.1 CV12.1 CV13.1 CV14.1 CV15.1 CV16.1 CV17.1 CV18.1 CV19.1 CV20.1 CV21.1 CV22.1 D7.K ISA1.B03(+5V) ISA1.B29(+5V) ISA1.D16(+5V) ISA2.B03(+5V) ISA2.B29(+5V) ISA2.D16(+5V) ISA3.B03(+5V) ISA3.B29(+5V) ISA3.D16(+5V) JIDE.2 L1.1 M1.10(VCC) M1.30(VCC) M1.59(VCC) M2.10(VCC) M2.30(VCC) M2.59(VCC) M3.10(VCC) M3.30(VCC) M3.59(VCC) M4.10(VCC) M4.30(VCC) M4.59(VCC) PCI0.A5(5V) PCI0.A8(5V) PCI0.A10(5V(IO)) PCI0.A16(5V(IO)) PCI0.A59(5V(IO)) PCI0.A61(5V) PCI0.A62(5V) PCI0.B5(5V) PCI0.B6(5V) PCI0.B19(5V(IO)) PCI0.B59(5V(IO)) PCI0.B61(5V) PCI0.B62(5V) PCI1.A5(5V) PCI1.A8(5V) PCI1.A10(5V(IO)) PCI1.A16(5V(IO)) PCI1.A59(5V(IO)) PCI1.A61(5V) PCI1.A62(5V) PCI1.B5(5V) PCI1.B6(5V) PCI1.B19(5V(IO)) PCI1.B59(5V(IO)) PCI1.B61(5V) PCI1.B62(5V) PCI2.A5(5V) PCI2.A8(5V) PCI2.A10(5V(IO)) PCI2.A16(5V(IO)) PCI2.A59(5V(IO)) PCI2.A61(5V) PCI2.A62(5V) PCI2.B5(5V) PCI2.B6(5V) PCI2.B19(5V(IO)) PCI2.B59(5V(IO)) PCI2.B61(5V) PCI2.B62(5V) Q2.E(e) R3.2 R5.1 R8.2 R11.2 R12.2 R13.2 R14.2 R17.1 R39.2 R41.1 R45.2 R47.2 R48.2 R55.1 R56.2 R57.2 R59.2 R60.2 R61.2 R62.2 R63.2 R64.2 RL1.2 RL2.2 RN51.2 RN52.2 RN53.2 RN54.2 RN55.2 RN56.2 RN57.2 RN58.2 RN59.2 RN60.2 RN61.2 RN62.2 RN63.2 RN64.2 RN65.2 RN66.2 RN67.2 RN68.2 RN69.2 RN70.2 RN71.2 RN72.2 RN73.2 RN74.2 RN75.2 RN76.2 RN77.2 RN78.2 RN79.2 RN80.2 RN81.2 RN82.2 RQ1.2 RQ2.2 RQ3.2 RQ4.2 RQ5.2 RQ6.2 RQ7.2 RQ8.2 RQ9.2 RQ10.2 RQ11.2 RQ12.2 RU3.1 RU4.2 U2.1(VPP) U2.30(NC) U2.32(VCC) U5.16(VCC) U7.20(VCC) U8.20(VCC) U9.20(VCC) U10.16(VCC) U12.20(VCC) U14.20(VCC) U16.1(DIR) U16.20(VCC) U17.20(VCC) U18.20(VCC) U19.20(VCC) UM2.8(IN+) UM4.7(IN-)
VCC5: Q1.2(C) R27.1 RU4.1 UM2.7(IN-)
VCC_CPU: C1.1 C2.1 C3.1 C4.1 C5.1 C6.1 C7.1 C13.1 C14.1 C15.1 C16.1 C17.1 C18.1 C19.1 C20.1 C21.1 C22.1 C23.1 CC12.1 CC13.1 CC14.1 CPU1.2(VCC) CPU1.7(BS16#) CPU1.8(BS8#) CPU1.9(VCC) CPU1.14(VCC) CPU1.19(VCC) CPU1.20(VCC) CPU1.22(VCC) CPU1.23(VCC) CPU1.25(VCC) CPU1.29(VCC) CPU1.35(VCC) CPU1.38(VCC) CPU1.42(VCC) CPU1.44(VCC) CPU1.45(VCC) CPU1.49(FLUSH#) CPU1.54(VCC) CPU1.56(VCC) CPU1.60(VCC) CPU1.62(VCC) CPU1.69(VCC) CPU1.77(VCC) CPU1.80(VCC) CPU1.82(VCC) CPU1.86(VCC) CPU1.89(VCC) CPU1.95(VCC) CPU1.98(VCC) CPU1.102(VCC) CPU1.106(VCC) CPU1.111(VCC) CPU1.114(VCC) CPU1.121(VCC) CPU1.128(VCC) CPU1.131(VCC) CPU1.133(VCC) CPU1.134(VCC) CPU1.136(VCC) CPU1.137(VCC) CPU1.139(VCC) CPU1.150(VCC) CPU1.155(VCC) CPU1.162(VCC) CPU1.163(VCC) CPU1.169(VCC) CPU1.172(VCC) CPU1.176(VCC) CPU1.179(VCC) CPU1.183(VCC) CPU1.185(VCC) CPU1.188(VCC) CPU1.191(VCC) CPU1.198(VCC) CPU1.200(VCC) CPU1.205(VCC) Q1.1(E) R31.1 R70.2 R71.2 R73.2 R74.2 RP212.2 RP213.2 RP214.2 RP221.2 RP222.2 RP223.2 RP224.2
12V: CU2.1 CU3.1 CU4.1 CU9.1 CU10.1 CU11.1 CU12.1 CU27.1 CU28.1 ISA1.B09(+12V) ISA2.B09(+12V) ISA3.B09(+12V) P1.5(VI+) PCI0.A2(12V) PCI1.A2(12V) PCI2.A2(12V) QM1.5(D) QM1.6(D) QM1.7(D) QM1.8(D) UM5.5(VIN) UM6.5(VIN) UM8.1(Vin)
32KIN: U13.3(32KIN/IRQ8) U15.6
33VCC: CT1.7 CT1.8 CT1.44 CT1.45 CV23.1 CV24.1 CV25.1 CV26.1 CV27.1 CV28.1 CV29.1 CV30.1 CV31.1 CV32.1 CV33.1 CV34.1 CV35.1 CV36.1 CV37.1 CV38.1 CV39.1 CV40.1 PCI0.A21(3.3V) PCI0.A27(3.3V) PCI0.A33(3.3V) PCI0.A39(3.3V) PCI0.A45(3.3V) PCI0.A53(3.3V) PCI0.B25(3.3V) PCI0.B31(3.3V) PCI0.B36(3.3V) PCI0.B41(3.3V) PCI0.B43(3.3V) PCI0.B54(3.3V) PCI1.A21(3.3V) PCI1.A27(3.3V) PCI1.A33(3.3V) PCI1.A39(3.3V) PCI1.A45(3.3V) PCI1.A53(3.3V) PCI1.B25(3.3V) PCI1.B31(3.3V) PCI1.B36(3.3V) PCI1.B41(3.3V) PCI1.B43(3.3V) PCI1.B54(3.3V) PCI2.A21(3.3V) PCI2.A27(3.3V) PCI2.A33(3.3V) PCI2.A39(3.3V) PCI2.A45(3.3V) PCI2.A53(3.3V) PCI2.B25(3.3V) PCI2.B31(3.3V) PCI2.B36(3.3V) PCI2.B41(3.3V) PCI2.B43(3.3V) PCI2.B54(3.3V) RU5.1 RV1.1 UM3.7(IN-)
-12V: CU25.2 CU26.2 ISA1.B07(-12V) ISA2.B07(-12V) ISA3.B07(-12V) P1.3(VO-) PCI0.B1(-12V) PCI1.B1(-12V) PCI2.B1(-12V)
A20M#: CPU1.47(A20M#) U13.7(A20M#)
AD0: U13.70(D0) U14.18(B0)
AD1: U13.69(D1) U14.17(B1)
AD2: CPU1.202(A2) CT1.42 U13.68(AD2) U14.16(B2)
AD3: CPU1.197(A3) CT1.41 U13.67(AD3) U14.15(B3)
AD4: CPU1.196(A4) CT1.29 U13.66(AD4) U14.14(B4)
AD5: CPU1.195(A5) CT1.30 U13.65(AD5) U14.13(B5)
AD6: CPU1.193(A6) CT1.31 U13.64(AD6) U14.12(B6)
AD7: CPU1.192(A7) CT1.32 U13.63(AD7) U14.11(B7)
AD8: CPU1.190(A8) CT1.33 U12.18(B0) U13.62(AD8)
AD9: CPU1.187(A9) CT1.34 U12.17(B1) U13.61(AD9)
AD10: CPU1.186(A10) CT1.35 U12.16(B2) U13.60(AD10)
AD11: CPU1.182(A11) CT1.36 U12.15(B3) U13.59(AD11)
AD12: CPU1.180(A12) CT1.23 U12.14(B4) U13.58(AD12)
AD13: CPU1.178(A13) CT1.22 U12.13(B5) U13.57(AD13)
AD14: CPU1.177(A14) CT1.21 U12.12(B6) U13.56(AD14)
AD15: CPU1.174(A15) CT1.19 U12.11(B7) U13.55(AD15)
AD16: CPU1.173(A16) CT1.28 U8.18(B0) U13.54(AD16)
AD17: CPU1.171(A17) CT1.27 U8.17(B1) U13.53(AD17)
AD18: CPU1.166(A18) CT1.24 U8.16(B2) U13.51(AD18)
AD19: CPU1.165(A19) U8.15(B3) U13.50(AD19)
AD20: CPU1.164(A20) U8.14(B4) U13.49(AD20)
AD21: CPU1.161(A21) U8.13(B5) U13.48(AD21)
AD22: CPU1.160(A22) U8.12(B6) U13.47(AD22)
AD23: CPU1.159(A23) U8.11(B7) U13.46(AD23)
AD24: CPU1.158(A24) U9.18(B0) U13.45(AD24)
AD24/HDA0: PCI0.A25(AD24) PCI1.A25(AD24) PCI2.A25(AD24) U13.110(AD24/HDA0) U16.5(A3)
AD25: CPU1.154(A25) U9.17(B1) U13.43(AD25)
AD25/HDA1: PCI0.B24(AD25) PCI1.B24(AD25) PCI2.B24(AD25) U13.149(AD25/HDA1) U16.8(A6)
AD26: CPU1.153(A26) U9.16(B2) U13.42(AD26)
AD26/HDA2: PCI0.A23(AD26) PCI1.A23(AD26) PCI2.A23(AD26) U13.109(AD26/HDA2) U16.4(A2)
AD27: CPU1.152(A27) U9.15(B3) U13.41(AD27)
AD27/HD17X#/ROMCS#: PCI0.B23(AD27) PCI1.B23(AD27) PCI2.B23(AD27) R10.2 U13.150(AD27/HD17X#/ROMCS#) U16.7(A5)
AD28: CPU1.151(A28) U9.14(B4) U13.40(AD28)
AD28/HD37X#/RTCCS#: PCI0.A22(AD28) PCI1.A22(AD28) PCI2.A22(AD28) U13.108(AD28/HD37X#/RTCCS#) U16.3(A1)
AD29: CPU1.149(A29) U9.13(B5) U13.39(AD29)
AD29/HD1FX#/KBCS#: PCI0.B21(AD29) PCI1.B21(AD29) PCI2.B21(AD29) U13.151(AD29/HD1FX#/KBCS#) U16.6(A4)
AD30: CPU1.148(A30) U9.12(B6) U13.38(AD30)
AD30/HD3FX#: PCI0.A20(AD30) PCI1.A20(AD30) PCI2.A20(AD30) U13.107(AD30/HD3FX#) U16.2(A0)
AD31: CPU1.147(A31) U9.11(B7) U13.37(AD31)
AD31/SBHE#: PCI0.B20(AD31) PCI1.B20(AD31) PCI2.B20(AD31) RP61.1 U13.152(AD31/SBHE#)
AD/LA/17: PCI0.B32(AD17) PCI1.B32(AD17) PCI2.B32(AD17) RP53.1 RP74.1 U13.144(AD17/LA17)
AD/LA/18: PCI0.A31(AD18) PCI1.A31(AD18) PCI2.A31(AD18) RP52.1 RP73.1 U13.113(AD18/LA18)
AD/LA/19: PCI0.B30(AD19) PCI1.B30(AD19) PCI2.B30(AD19) R118.1 RP51.1 RP72.1 U13.145(AD19/LA19)
AD/LA/20: PCI0.A29(AD20) PCI1.A29(AD20) PCI2.A29(AD20) R18.1 RP71.1 U13.112(AD20/LA20)
AD/LA/21: PCI0.B29(AD21) PCI1.B29(AD21) PCI2.B29(AD21) R19.1 RP64.1 U13.146(AD21/LA21)
AD/LA/22: PCI0.A28(AD22) PCI1.A28(AD22) PCI2.A28(AD22) RP63.1 U13.111(AD22/LA22)
AD/LA/23: PCI0.B27(AD23) PCI1.B27(AD23) PCI2.B27(AD23) RP62.1 U13.147(AD23/LA23)
AD/SA/16: PCI0.A32(AD16) PCI1.A32(AD16) PCI2.A32(AD16) RP54.1 U13.114(AD16/SA16) U19.6(I5)
AD/SD/0: PCI0.A58(AD00) PCI1.A58(AD00) PCI2.A58(AD00) RD19.1 U13.127(AD0/SD0)
AD/SD/1: PCI0.B58(AD01) PCI1.B58(AD01) PCI2.B58(AD01) RD20.1 U13.133(AD1/SD1)
AD/SD/2: PCI0.A57(AD02) PCI1.A57(AD02) PCI2.A57(AD02) RD21.1 U13.125(AD2/SD2)
AD/SD/3: PCI0.B56(AD03) PCI1.B56(AD03) PCI2.B56(AD03) RD22.1 U13.134(AD3/SD3)
AD/SD/4: PCI0.A55(AD04) PCI1.A55(AD04) PCI2.A55(AD04) RD23.1 U13.124(AD4/SD4)
AD/SD/5: PCI0.B55(AD05) PCI1.B55(AD05) PCI2.B55(AD05) RD24.1 U13.131(AD5/SD5)
AD/SD/6: PCI0.A54(AD06) PCI1.A54(AD06) PCI2.A54(AD06) RD25.1 U13.126(AD6/SD6)
AD/SD/7: PCI0.B53(AD07) PCI1.B53(AD07) PCI2.B53(AD07) RD26.1 U13.130(AD7/SD7)
AD/SD/8: PCI0.B52(AD08) PCI1.B52(AD08) PCI2.B52(AD08) RD27.1 U13.132(AD8/SD8)
AD/SD/9: PCI0.A49(AD09) PCI1.A49(AD09) PCI2.A49(AD09) RD28.1 U13.123(AD9/SD9)
AD/SD/10: PCI0.B48(AD10) PCI1.B48(AD10) PCI2.B48(AD10) RD29.1 U13.135(AD10/SD10)
AD/SD/11: PCI0.A47(AD11) PCI1.A47(AD11) PCI2.A47(AD11) RD30.1 U13.122(AD11/SD11)
AD/SD/12: PCI0.B47(AD12) PCI1.B47(AD12) PCI2.B47(AD12) RD31.1 U13.136(AD12/SD12)
AD/SD/13: PCI0.A46(AD13) PCI1.A46(AD13) PCI2.A46(AD13) RD32.1 U13.121(AD13/SD13)
AD/SD/14: PCI0.B45(AD14) PCI1.B45(AD14) PCI2.B45(AD14) RD33.1 U13.137(AD14/SD14)
AD/SD/15: PCI0.A44(AD15) PCI1.A44(AD15) PCI2.A44(AD15) RD34.1 U13.120(AD15/SD15)
ADS#: CPU1.203(ADS#) CT2.48 R45.1 U13.27(ADS#)
ADV#: CT2.6 U13.33(ADV#)
AHOLD: CPU1.17(AHOLD) U13.23(AHOLD)
BE0#: CPU1.31(BE0#) CT2.2 RP221.1 U13.31(BE0#)
BE1#: CPU1.32(BE1#) CT2.50 RP222.1 U13.30(BE1#)
BE2#: CPU1.33(BE2#) CT2.1 RP223.1 U13.29(BE2#)
BE3#: CPU1.34(BE3#) CT2.51 RP224.1 U13.28(BE3#)
BOFF#: CPU1.6(BOFF#) U13.22(BOFF#)
BRDY#: CPU1.5(BRDY#) U13.14(BRDY#)
BWE#: CT2.49 U13.34(BWE#)
CACHE#: R68.2 R69.1 U13.17(PCD/CACHE#)
CAS0#: RM20.1 U13.92(CAS0#)
CAS1#: RM19.1 U13.91(CAS1#)
CAS2#: RM18.1 U13.90(CAS2#)
CAS3#: RM17.1 U13.89(CAS3#)
CLK244: U6.8(CLK(PCI/HCLK/PCLK)) U7.2(1A1) U7.4(1A2) U7.11(2A1) U7.13(2A2) U7.15(2A3) U7.17(2A4)
CLK_PRIME3C: J1.2
CLKIO: R1.2 U6.5(CLK(IO))
CLKMUL: CPU1.11(CLKMUL) R72.1
CLKOSC: R22.1 R23.1 U6.4(CLK(OSC))
COE#: CT2.5 U13.35(COE#)
CPUCLK: CPU1.24(CLK) R25.1
D+: UM9.5(UD+) USB1.3(D+(DP))
D-: UM9.6(UD-) USB1.2(D-(DM))
D/C#: CPU1.39(D/C#) CPU1.71(INV) RP214.1 U13.24(D/C#)
DDIR: U8.1(DIR) U9.1(DIR) U12.1(DIR) U14.1(DIR) U16.11(B7)
DEVSEL#: R67.2 U13.141(DEVSEL#) U19.19(I/O1)
DOE#: U8.19(~{OE}) U9.19(~{OE}) U12.19(~{OE}) U13.72(DOE#) U14.19(~{OE})
EADS#: CPU1.46(EADS#) U13.21(EADS#)
FERR#: CPU1.66(FERR#) R57.1 U13.19(FERR#)
GW#: CT2.4 U13.36(GW#)
HCLK: R26.1 R62.1 U13.103(HCLK)
HD0: CPU1.144(D0) CT2.25 M1.2(D0) M2.2(D0) M3.2(D0) M4.2(D0) U14.2(A0)
HD1: CPU1.143(D1) CT2.28 M1.4(D1) M2.4(D1) M3.4(D1) M4.4(D1) U14.3(A1)
HD2: CPU1.142(D2) CT2.24 M1.6(D2) M2.6(D2) M3.6(D2) M4.6(D2) U14.4(A2)
HD3: CPU1.141(D3) CT2.29 M1.8(D3) M2.8(D3) M3.8(D3) M4.8(D3) U14.5(A3)
HD4: CPU1.140(D4) CT2.23 M1.20(D4) M2.20(D4) M3.20(D4) M4.20(D4) U14.6(A4)
HD5: CPU1.130(D5) CT2.30 M1.22(D5) M2.22(D5) M3.22(D5) M4.22(D5) U14.7(A5)
HD6: CPU1.129(D6) CT2.22 M1.24(D6) M2.24(D6) M3.24(D6) M4.24(D6) U14.8(A6)
HD7: CPU1.126(D7) CT2.31 M1.26(D7) M2.26(D7) M3.26(D7) M4.26(D7) U14.9(A7)
HD8: CPU1.124(D8) CT2.20 M1.49(D8) M2.49(D8) M3.49(D8) M4.49(D8) U12.2(A0)
HD9: CPU1.123(D9) CT2.33 M1.51(D9) M2.51(D9) M3.51(D9) M4.51(D9) U12.3(A1)
HD10: CPU1.119(D10) CT2.19 M1.53(D10) M2.53(D10) M3.53(D10) M4.53(D10) U12.4(A2)
HD11: CPU1.118(D11) CT2.34 M1.55(D11) M2.55(D11) M3.55(D11) M4.55(D11) U12.5(A3)
HD12: CPU1.117(D12) CT2.18 M1.57(D12) M2.57(D12) M3.57(D12) M4.57(D12) U12.6(A4)
HD13: CPU1.116(D13) CT2.35 M1.61(D13) M2.61(D13) M3.61(D13) M4.61(D13) U12.7(A5)
HD14: CPU1.113(D14) CT2.17 M1.63(D14) M2.63(D14) M3.63(D14) M4.63(D14) U12.8(A6)
HD15: CPU1.112(D15) CT2.36 M1.65(D15) M2.65(D15) M3.65(D15) M4.65(D15) U12.9(A7)
HD16: CPU1.108(D16) CT2.15 M1.3(D16) M2.3(D16) M3.3(D16) M4.3(D16) U8.2(A0)
HD17: CPU1.103(D17) CT2.38 M1.5(D17) M2.5(D17) M3.5(D17) M4.5(D17) U8.3(A1)
HD18: CPU1.101(D18) CT2.14 M1.7(D18) M2.7(D18) M3.7(D18) M4.7(D18) U8.4(A2)
HD19: CPU1.100(D19) CT2.39 M1.9(D19) M2.9(D19) M3.9(D19) M4.9(D19) U8.5(A3)
HD20: CPU1.99(D20) CT2.13 M1.21(D20) M2.21(D20) M3.21(D20) M4.21(D20) U8.6(A4)
HD21: CPU1.93(D21) CT2.40 M1.23(D21) M2.23(D21) M3.23(D21) M4.23(D21) U8.7(A5)
HD22: CPU1.92(D22) CT2.12 M1.25(D22) M2.25(D22) M3.25(D22) M4.25(D22) U8.8(A6)
HD23: CPU1.91(D23) CT2.41 M1.27(D23) M2.27(D23) M3.27(D23) M4.27(D23) U8.9(A7)
HD24: CPU1.87(D24) CT2.10 M1.50(D24) M2.50(D24) M3.50(D24) M4.50(D24) U9.2(A0)
HD25: CPU1.85(D25) CT2.43 M1.52(D25) M2.52(D25) M3.52(D25) M4.52(D25) U9.3(A1)
HD26: CPU1.84(D26) CT2.9 M1.54(D26) M2.54(D26) M3.54(D26) M4.54(D26) U9.4(A2)
HD27: CPU1.83(D27) CT2.44 M1.56(D27) M2.56(D27) M3.56(D27) M4.56(D27) U9.5(A3)
HD28: CPU1.79(D28) CT2.8 M1.58(D28) M2.58(D28) M3.58(D28) M4.58(D28) U9.6(A4)
HD29: CPU1.78(D29) CT2.45 M1.60(D29) M2.60(D29) M3.60(D29) M4.60(D29) U9.7(A5)
HD30: CPU1.75(D30) CT2.7 M1.62(D30) M2.62(D30) M3.62(D30) M4.62(D30) U9.8(A6)
HD31: CPU1.74(D31) CT2.46 M1.64(D31) M2.64(D31) M3.64(D31) M4.64(D31) U9.9(A7)
HDRD#: RD17.1 U13.5(HDRD#)
HDWE#: RD18.1 U13.4(HDWE#)
HITM#: CPU1.63(HITM#) R56.1 U13.20(HITM#)
IDE1_CS: IDE1.28(Cable_select) R63.1
IDE1_CS1P: IDE1.37(Chip_Select_1P) U16.14(B4)
IDE1_CS3P: IDE1.38(Chip_Select_3P) U16.18(B0)
IDE2_CS: IDE2.28(Cable_select) R64.1
IDE2_CS1P: IDE2.37(Chip_Select_1P) U16.13(B5)
IDE2_CS3P: IDE2.38(Chip_Select_3P) U16.17(B1)
IDE_D0: IDE1.17(D0) IDE2.17(D0) RD1.2
IDE_D1: IDE1.15(D1) IDE2.15(D1) RD2.2
IDE_D2: IDE1.13(D2) IDE2.13(D2) RD3.2
IDE_D3: IDE1.11(D3) IDE2.11(D3) RD4.2
IDE_D4: IDE1.9(D4) IDE2.9(D4) RD5.2
IDE_D5: IDE1.7(D5) IDE2.7(D5) RD6.2
IDE_D6: IDE1.5(D6) IDE2.5(D6) RD7.2
IDE_D7: IDE1.3(D7) IDE2.3(D7) RD8.2
IDE_D8: IDE1.4(D8) IDE2.4(D8) RD9.2
IDE_D9: IDE1.6(D9) IDE2.6(D9) RD10.2
IDE_D10: IDE1.8(D10) IDE2.8(D10) RD11.2
IDE_D11: IDE1.10(D11) IDE2.10(D11) RD12.2
IDE_D12: IDE1.12(D12) IDE2.12(D12) RD13.2
IDE_D13: IDE1.14(D13) IDE2.14(D13) RD14.2
IDE_D14: IDE1.16(D14) IDE2.16(D14) RD15.2
IDE_D15: IDE1.18(D15) IDE2.18(D15) RD16.2
IDE_HDA0: IDE1.35(Addr0) IDE2.35(Addr0) U16.15(B3)
IDE_HDA1: IDE1.33(Addr1) IDE2.33(Addr1) U16.12(B6)
IDE_HDA2: IDE1.36(Addr2) IDE2.36(Addr2) U16.16(B2)
IDE_IOCS16#: IDE1.32(~{IOCS16}(NC)) IDE2.32(~{IOCS16}(NC)) R49.1
IDE_P20: IDE1.20(NC) IDE2.20(NC) JIDE.1
IDE_RD#: IDE1.25(~{IOR}) IDE2.25(~{IOR}) RD17.2
IDE_WE#: IDE1.23(~{IOW}) IDE2.23(~{IOW}) RD18.2
IGNNE#: CPU1.72(IGNNE#) U13.6(IGNNE#)
INA219_SCL: RU20.2 RU22.1 UM2.4(SCL) UM3.4(SCL) UM4.4(SCL)
INA219_SDA: RU19.2 RU21.1 UM2.3(SDA) UM3.3(SDA) UM4.3(SDA)
INTR: CPU1.50(INTR) U13.8(INTR#)
ISA_A0: ISA1.A31(A0) ISA2.A31(A0) ISA3.A31(A0) U2.12(A0) U17.18(B0)
ISA_A1: ISA1.A30(A1) ISA2.A30(A1) ISA3.A30(A1) U2.11(A1) U17.17(B1)
ISA_A2: ISA1.A29(A2) ISA2.A29(A2) ISA3.A29(A2) U2.10(A2) U17.16(B2)
ISA_A3: ISA1.A28(A3) ISA2.A28(A3) ISA3.A28(A3) U2.9(A3) U17.15(B3)
ISA_A4: ISA1.A27(A4) ISA2.A27(A4) ISA3.A27(A4) U2.8(A4) U17.14(B4)
ISA_A5: ISA1.A26(A5) ISA2.A26(A5) ISA3.A26(A5) U2.7(A5) U17.13(B5)
ISA_A6: ISA1.A25(A6) ISA2.A25(A6) ISA3.A25(A6) U2.6(A6) U17.12(B6)
ISA_A7: ISA1.A24(A7) ISA2.A24(A7) ISA3.A24(A7) U2.5(A7) U17.11(B7)
ISA_A8: ISA1.A23(A8) ISA2.A23(A8) ISA3.A23(A8) U2.27(A8) U18.18(B0)
ISA_A9: ISA1.A22(A9) ISA2.A22(A9) ISA3.A22(A9) U2.26(A9) U18.17(B1)
ISA_A10: ISA1.A21(A10) ISA2.A21(A10) ISA3.A21(A10) U2.23(A10) U18.16(B2)
ISA_A11: ISA1.A20(A11) ISA2.A20(A11) ISA3.A20(A11) U2.25(A11) U18.15(B3)
ISA_A12: ISA1.A19(A12) ISA2.A19(A12) ISA3.A19(A12) U2.4(A12) U18.14(B4)
ISA_A13: ISA1.A18(A13) ISA2.A18(A13) ISA3.A18(A13) U2.28(A13) U18.13(B5)
ISA_A14: ISA1.A17(A14) ISA2.A17(A14) ISA3.A17(A14) U2.29(A14) U18.12(B6)
ISA_A15: ISA1.A16(A15) ISA2.A16(A15) ISA3.A16(A15) U2.3(A15) U18.11(B7)
ISA_A16: ISA1.A15(A16) ISA2.A15(A16) ISA3.A15(A16) RP54.2 U2.2(A16)
ISA_A17: ISA1.A14(A17) ISA2.A14(A17) ISA3.A14(A17) RP53.2
ISA_A18: ISA1.A13(A18) ISA2.A13(A18) ISA3.A13(A18) RP52.2
ISA_A19: ISA1.A12(A19) ISA2.A12(A19) ISA3.A12(A19) RP51.2
ISA_AEN: ISA1.A11(AEN) ISA2.A11(AEN) ISA3.A11(AEN) RN78.1 U13.159(AEN)
ISA_ALE: ISA1.B28(ALE) ISA2.B28(ALE) ISA3.B28(ALE) R33.1
ISA_B8: ISA1.B08(NC) ISA2.B08(NC) ISA3.B08(NC) RN72.1
ISA_BHE#: ISA1.C1(BHE) ISA2.C1(BHE) ISA3.C1(BHE) RN77.1 RP61.2
ISA_CLK: ISA1.B20(CLOCK) ISA2.B20(CLOCK) ISA3.B20(CLOCK) R35.1 U5.2(A1) U10.2(A1)
ISA_D0: ISA1.A09(D0) ISA2.A09(D0) ISA3.A09(D0) RD19.2 U2.13(I/O0)
ISA_D1: ISA1.A08(D1) ISA2.A08(D1) ISA3.A08(D1) RD20.2 U2.14(I/O1)
ISA_D2: ISA1.A07(D2) ISA2.A07(D2) ISA3.A07(D2) RD21.2 U2.15(I/O2)
ISA_D3: ISA1.A06(D3) ISA2.A06(D3) ISA3.A06(D3) RD22.2 U2.17(I/O3)
ISA_D4: ISA1.A05(D4) ISA2.A05(D4) ISA3.A05(D4) RD23.2 U2.18(I/O4)
ISA_D5: ISA1.A04(D5) ISA2.A04(D5) ISA3.A04(D5) RD24.2 U2.19(I/O5)
ISA_D6: ISA1.A03(D6) ISA2.A03(D6) ISA3.A03(D6) RD25.2 U2.20(I/O6)
ISA_D7: ISA1.A02(D7) ISA2.A02(D7) ISA3.A02(D7) RD26.2 U2.21(I/O7)
ISA_D8: ISA1.C11(D8) ISA2.C11(D8) ISA3.C11(D8) RD27.2
ISA_D9: ISA1.C12(D9) ISA2.C12(D9) ISA3.C12(D9) RD28.2
ISA_D10: ISA1.C13(D10) ISA2.C13(D10) ISA3.C13(D10) RD29.2
ISA_D11: ISA1.C14(D11) ISA2.C14(D11) ISA3.C14(D11) RD30.2
ISA_D12: ISA1.C15(D12) ISA2.C15(D12) ISA3.C15(D12) RD31.2
ISA_D13: ISA1.C16(D13) ISA2.C16(D13) ISA3.C16(D13) RD32.2
ISA_D14: ISA1.C17(D14) ISA2.C17(D14) ISA3.C17(D14) RD33.2
ISA_D15: ISA1.C18(D15) ISA2.C18(D15) ISA3.C18(D15) RD34.2
ISA_DACK#0: ISA1.D8(~{DACK}0) ISA2.D8(~{DACK}0) ISA3.D8(~{DACK}0) U13.193(DACK0#)
ISA_DACK#1: ISA1.B17(~{DACK1}) ISA2.B17(~{DACK1}) ISA3.B17(~{DACK1}) U13.169(DACK1#)
ISA_DACK#2: ISA1.B26(~{DACK2}) ISA2.B26(~{DACK2}) ISA3.B26(~{DACK2}) U13.182(DACK2#)
ISA_DACK#3: ISA1.B15(~{DACK3}) ISA2.B15(~{DACK3}) ISA3.B15(~{DACK3}) U13.164(DACK3#)
ISA_DACK#5: ISA1.D10(~{DACK5}) ISA2.D10(~{DACK5}) ISA3.D10(~{DACK5}) U13.197(DACK5#)
ISA_DACK#6: ISA1.D12(~{DACK6}) ISA2.D12(~{DACK6}) ISA3.D12(~{DACK6}) U13.199(DACK6#)
ISA_DACK#7: ISA1.D14(~{DACK7}) ISA2.D14(~{DACK7}) ISA3.D14(~{DACK7}) U13.201(DACK7#)
ISA_DRQ0: ISA1.D9(DRQ0) ISA2.D9(DRQ0) ISA3.D9(DRQ0) R100.1 U13.195(DREQ0)
ISA_DRQ1: ISA1.B18(DRQ1) ISA2.B18(DRQ1) ISA3.B18(DRQ1) R101.1 U13.171(DREQ1)
ISA_DRQ2: D1.K ISA1.B06(DRQ2) ISA2.B06(DRQ2) ISA3.B06(DRQ2) R102.1 U13.157(DREQ2)
ISA_DRQ3: ISA1.B16(DRQ3) ISA2.B16(DRQ3) ISA3.B16(DRQ3) R103.1 U13.167(DREQ3)
ISA_DRQ5: ISA1.D11(DRQ5) ISA2.D11(DRQ5) ISA3.D11(DRQ5) R105.1 U13.198(DREQ5)
ISA_DRQ6: ISA1.D13(DRQ6) ISA2.D13(DRQ6) ISA3.D13(DRQ6) R106.1 U13.200(DREQ6)
ISA_DRQ7: ISA1.D15(DRQ7) ISA2.D15(DRQ7) ISA3.D15(DRQ7) R107.1 U13.202(DREQ7)
ISA_IOCHCK#: ISA1.A01(~{I/O_CH_CK}) ISA2.A01(~{I/O_CH_CK}) ISA3.A01(~{I/O_CH_CK}) R3.1
ISA_IOCHRDY: IDE1.27(IOCHRDY) IDE2.27(IOCHRDY) ISA1.A10(I/O_CH_RDY) ISA2.A10(I/O_CH_RDY) ISA3.A10(I/O_CH_RDY) R8.1 U13.158(IOCHRDY)
ISA_IOCS16#: ISA1.D2(~{IOCS16}) ISA2.D2(~{IOCS16}) ISA3.D2(~{IOCS16}) RN74.1 U13.192(IOCS16#)
ISA_IOR#: ISA1.B14(~{IOR}) ISA2.B14(~{IOR}) ISA3.B14(~{IOR}) RN82.1 RP23.1
ISA_IOW#: ISA1.B13(~{IOW}) ISA2.B13(~{IOW}) ISA3.B13(~{IOW}) RN81.1 RP24.1
ISA_IRQ2: ISA1.B04(IRQ2) ISA2.B04(IRQ2) ISA3.B04(IRQ2) RQ1.1 U10.5(1C1)
ISA_IRQ3: ISA1.B25(IRQ3) ISA2.B25(IRQ3) ISA3.B25(IRQ3) RQ2.1 U5.10(2C0)
ISA_IRQ4: ISA1.B24(IRQ4) ISA2.B24(IRQ4) ISA3.B24(IRQ4) RQ3.1 U5.11(2C1)
ISA_IRQ5: ISA1.B23(IRQ5) ISA2.B23(IRQ5) ISA3.B23(IRQ5) RQ4.1 U5.12(2C2)
ISA_IRQ6: ISA1.B22(IRQ6) ISA2.B22(IRQ6) ISA3.B22(IRQ6) RQ5.1 U5.13(2C3)
ISA_IRQ7: ISA1.B21(IRQ7) ISA2.B21(IRQ7) ISA3.B21(IRQ7) RQ6.1 U10.6(1C0)
ISA_IRQ10: ISA1.D3(IRQ10) ISA2.D3(IRQ10) ISA3.D3(IRQ10) RQ7.1 U10.4(1C2)
ISA_IRQ11: ISA1.D4(IRQ11) ISA2.D4(IRQ11) ISA3.D4(IRQ11) RQ8.1 U10.3(1C3)
ISA_IRQ12: ISA1.D5(IRQ12) ISA2.D5(IRQ12) ISA3.D5(IRQ12) RQ9.1 U10.10(2C0)
ISA_IRQ14: IDE2.31(IRQ) ISA1.D7(IRQ14) ISA2.D7(IRQ14) ISA3.D7(IRQ14) RQ10.1 U10.11(2C1)
ISA_IRQ15: IDE1.31(IRQ) ISA1.D6(IRQ15) ISA2.D6(IRQ15) ISA3.D6(IRQ15) RQ11.1 U10.12(2C2)
ISA_LA17: ISA1.C8(A17) ISA2.C8(A17) ISA3.C8(A17) RP74.2
ISA_LA18: ISA1.C7(A18) ISA2.C7(A18) ISA3.C7(A18) RP73.2
ISA_LA19: ISA1.C6(A19) ISA2.C6(A19) ISA3.C6(A19) RP72.2
ISA_LA20: ISA1.C5(A20) ISA2.C5(A20) ISA3.C5(A20) RP71.2
ISA_LA21: ISA1.C4(A21) ISA2.C4(A21) ISA3.C4(A21) RP64.2
ISA_LA22: ISA1.C3(A22) ISA2.C3(A22) ISA3.C3(A22) RP63.2
ISA_LA23: ISA1.C2(A23) ISA2.C2(A23) ISA3.C2(A23) RP62.2
ISA_MASTER#: ISA1.D17(~{MASTER}) ISA2.D17(~{MASTER}) ISA3.D17(~{MASTER}) U17.1(DIR) U18.1(DIR)
ISA_MEMCS16#: ISA1.D1(~{MEMCS16}) ISA2.D1(~{MEMCS16}) ISA3.D1(~{MEMCS16}) RN73.1 U13.191(MCS16#)
ISA_MEMR#: ISA1.C9(~{MEMR}) ISA2.C9(~{MEMR}) ISA3.C9(~{MEMR}) R36.1 RN75.1 U2.24(~{OE})
ISA_MEMW#: ISA1.C10(~{MEMW}) ISA2.C10(~{MEMW}) ISA3.C10(~{MEMW}) R37.1 RN76.1 U2.31(~{PGM})
ISA_OSC: ISA1.B30(OSC) ISA2.B30(OSC) ISA3.B30(OSC) J1.3 R23.2 U5.14(A0) U10.14(A0)
ISA_REFRESH#: ISA1.B19(~{DACK0}/~{REFRESH}) ISA2.B19(~{DACK0}/~{REFRESH}) ISA3.B19(~{DACK0}/~{REFRESH}) RN71.1
ISA_RESET: CPU1.48(RESET) ISA1.B02(RESET_DRV) ISA2.B02(RESET_DRV) ISA3.B02(RESET_DRV) R48.1 U13.203(RESETDRV) U19.5(I4)
ISA_SMEMR#: ISA1.B12(~{MEMR}) ISA2.B12(~{MEMR}) ISA3.B12(~{MEMR}) RN80.1 RP21.1
ISA_SMEMW#: ISA1.B11(~{MEMW}) ISA2.B11(~{MEMW}) ISA3.B11(~{MEMW}) RN79.1 RP22.1
ISA_T/C: ISA1.B27(T/C) ISA2.B27(T/C) ISA3.B27(T/C) U13.184(TC)
KBCLK: C8.2 R2.1 RK1.1 U13.100(KBCLK/IRQ1)
KBDATA: C12.2 R6.1 RK2.1 U13.99(KBDATA/RC#)
KEN#: CPU1.13(KEN#) U13.12(KEN#)
KEYLOCK: CN11.1 RQ12.1 U10.13(2C3)
LHD1: IDE1.39(Activity) LHD1.2
LHD2: IDE2.39(Activity) LHD2.2
LOCK#: CPU1.207(LOCK#) R73.1 U13.16(LOCK#)
M/IO#: CPU1.37(M/IO#) RP212.1 U13.26(M/IO#)
MA0: M1.12(A0) M2.12(A0) M3.12(A0) M4.12(A0) RM1.2
MA1: M1.13(A1) M2.13(A1) M3.13(A1) M4.13(A1) RM2.2
MA2: M1.14(A2) M2.14(A2) M3.14(A2) M4.14(A2) RM3.2
MA3: M1.15(A3) M2.15(A3) M3.15(A3) M4.15(A3) RM4.2
MA4: M1.16(A4) M2.16(A4) M3.16(A4) M4.16(A4) RM5.2
MA4/TA0: CT1.17 RM5.1 U13.83(MA4/TA0)
MA5: M1.17(A5) M2.17(A5) M3.17(A5) M4.17(A5) RM6.2
MA5/TA1: CT1.16 RM6.1 U13.82(MA5/TA1)
MA6: M1.18(A6) M2.18(A6) M3.18(A6) M4.18(A6) RM7.2
MA6/TA2: CT1.15 RM7.1 U13.81(MA6/TA2)
MA7: M1.28(A7) M2.28(A7) M3.28(A7) M4.28(A7) RM8.2
MA7/TA3: CT1.14 RM8.1 U13.80(MA7/TA3)
MA8: M1.31(A8) M2.31(A8) M3.31(A8) M4.31(A8) RM9.2
MA8/TA4: CT1.13 RM9.1 U13.79(MA8/TA4)
MA9: M1.32(A9) M2.32(A9) M3.32(A9) M4.32(A9) RM10.2
MA9/TA5: CT1.39 RM10.1 U13.78(MA9/TA5)
MA10: M1.19(A10) M2.19(A10) M3.19(A10) M4.19(A10) RM11.2
MA10/TA6: CT1.38 RM11.1 U13.77(MA10/TA6)
MA11: M1.29(A11(NC)) M2.29(A11(NC)) M3.29(A11(NC)) M4.29(A11(NC)) RM12.2
MA11/TA7: CT1.37 RM12.1 U13.76(MA11/TA7)
MA/CFG/0: RM1.1 U13.87(MA0/CFG0)
MA/CFG/1: RM2.1 U13.86(MA1/CFG1)
MA/CFG/2: RM3.1 U13.85(MA2/CFG2)
MA/CFG/3: RM4.1 U13.84(MA3/CFG3)
MCAS#0: M1.40(~{CAS0}) M2.40(~{CAS0}) M3.40(~{CAS0}) M4.40(~{CAS0}) RM20.2
MCAS#1: M1.43(~{CAS1}) M2.43(~{CAS1}) M3.43(~{CAS1}) M4.43(~{CAS1}) RM19.2
MCAS#2: M1.41(~{CAS2}) M2.41(~{CAS2}) M3.41(~{CAS2}) M4.41(~{CAS2}) RM18.2
MCAS#3: M1.42(~{CAS3}) M2.42(~{CAS3}) M3.42(~{CAS3}) M4.42(~{CAS3}) RM17.2
MCU_ADC1: UM1.36(P0.0/AD0/ADC8/RXD3)
MCU_AVCC: CU23.1 CU24.1 LU3.1 UM1.12(ADC_AVCC)
MCU_K1: KM1.2 UM1.17(P4.0/WR_3/RXD2_2)
MCU_K2: KM2.2 UM1.26(P4.1/ALE/CMPO_2)
MCU_K3: UM1.28(P4.2/RD_3/TXD2_2)
MCU_K4: UM1.39(P4.3/WR/RXD_4)
MCU_K5: UM1.6(P4.4/RD/TXD_4)
MCU_K6: UM1.15(P5.5)
MCU_K7: UM1.13(P5.4/RST/MCLKO)
MCU_K8: UM1.25(P3.7/INT3/RD_2/TXD_2/CMP+)
MRAS#0: M3.33(~{RAS3}) M3.45(~{RAS1}) M4.34(~{RAS2}) M4.44(~{RAS0}) RM16.2
MRAS#1: M1.34(~{RAS2}) M1.44(~{RAS0}) M2.33(~{RAS3}) M2.45(~{RAS1}) RM15.2
MRAS#2: M3.34(~{RAS2}) M3.44(~{RAS0}) M4.33(~{RAS3}) M4.45(~{RAS1}) RM14.2
MRAS#3: M1.33(~{RAS3}) M1.45(~{RAS1}) M2.34(~{RAS2}) M2.44(~{RAS0}) RM13.2
MUXINT0: RN67.1 U5.7(1Y) U13.208(MUXINT0)
MUXINT1: RN68.1 U5.9(2Y) U13.207(MUXINT1)
MUXINT2: RN69.1 U10.7(1Y) U13.206(MUXINT2)
MUXINT3: RN70.1 U10.9(2Y) U13.205(MUXINT3)
MWE#: R38.2 U13.98(MWE#)
MWE#R: M1.47(~{WE}) M2.47(~{WE}) M3.47(~{WE}) M4.47(~{WE}) R38.1
NMI: CPU1.51(NMI) U13.9(NMI)
OSCIN: R22.2 R61.1 U13.102(OSCIN)
P01: UM1.37(P0.1/AD1/ADC9/TXD3)
P10: JM1.3 UM1.1(P1.0/ADC0/PWM0_2/RXD2)
P11: JM1.4 UM1.2(P1.1/ADC1/PWM1_2/TXD2)
P12: JM1.5 UM1.3(P1.2/ADC2/PWM2_2/SS/T2/ECI)
P13: JM1.6 UM1.4(P1.3/ADC3/PWM3_2/MOSI/T2CLKO)
P14: UM1.5(P1.4/ADC4/PWM4_2/MISO/SDA/CCP3)
P15: UM1.7(P1.5/ADC5/PWM5_2/SCLK/SCL/CCP2)
P16: UM1.8(P1.6/ADC6/RXD3/PWM6_2/MCLKO2/CCP1/XTALO)
P17: UM1.9(P1.7/ADC7/TXD_3/PWM7_2/CCP0/XTALI)
P20: JM1.7 UM1.27(P2.0/A8/PWM0/RSTSV)
P21: JM1.8 UM1.29(P2.1/A9/PWM1)
P22: UM1.30(P2.2/A10/PWM2/SS_2/ECI_2)
P23: UM1.31(P2.3/A11/PWM3/MOSI_2/CCP0_2)
P24: UM1.32(P2.4/A12/PWM4/MISO_2/SDA_2/CCP1_2)
P25: UM1.33(P2.5/A13/PWM5/SCLK_2/SCL_2/CCP2_2)
P26: UM1.34(P2.6/A14/PWM6/CCP3_2)
P27: UM1.35(P2.7/A15/PWM7)
P32: UM1.20(P3.2/INT0/CCP1_4/SCLK_4/SCL_4)
P33: UM1.21(P3.3/INT1/CCP0_4/MISO_4/SDA_4)
P34: UM1.22(P3.4/T0/T1CLKO/MOSI_4/CMPO)
PCD: CPU1.41(PCD) R59.1 R68.1
PCI1_GNT#: R12.1 U13.155(GNT0#)
PCI1_REQ#: R11.1 U13.154(REQ0#)
PCI2_GNT#: PCI0.A17(~{GNT}) PCI1.A17(~{GNT}) PCI2.A17(~{GNT}) R13.1 U13.106(GNT1#)
PCI2_REQ#: PCI0.B18(~{REQ}) PCI1.B18(~{REQ}) PCI2.B18(~{REQ}) R14.1 U13.105(REQ1#)
PCI_CBE0#: PCI0.A52(~{C/BE0}) PCI1.A52(~{C/BE0}) PCI2.A52(~{C/BE0}) RN55.1 U13.128(CBE0#)
PCI_CBE1#: PCI0.B44(~{C/BE1}) PCI1.B44(~{C/BE1}) PCI2.B44(~{C/BE1}) RN56.1 U13.139(CBE1#)
PCI_CBE2#: PCI0.B33(~{C/BE2}) PCI1.B33(~{C/BE2}) PCI2.B33(~{C/BE2}) RN57.1 U13.143(CBE2#)
PCI_CBE3#: PCI0.B26(~{C/BE3}) PCI1.B26(~{C/BE3}) PCI2.B26(~{C/BE3}) RN58.1 U13.148(CBE3#)
PCI_DEVSEL#: PCI0.B37(~{DEVSEL}) PCI1.B37(~{DEVSEL}) PCI2.B37(~{DEVSEL}) R67.1 RN62.1
PCI_FRAME#: PCI0.A34(~{FRAME}) PCI1.A34(~{FRAME}) PCI2.A34(~{FRAME}) RN59.1 U13.116(FRAME#) U19.7(I6)
PCI_INT1#: PCI0.A7(~{INTC}) PCI1.B8(~{INTD}) PCI2.A7(~{INTC}) RN51.1 U5.6(1C0)
PCI_INT2#: PCI0.B7(~{INTB}) PCI1.A6(~{INTA}) PCI2.B8(~{INTD}) RN52.1 U5.5(1C1)
PCI_INT3#: PCI0.A6(~{INTA}) PCI1.B7(~{INTB}) PCI2.A6(~{INTA}) RN53.1 U5.4(1C2)
PCI_INT4#: PCI0.B8(~{INTD}) PCI1.A7(~{INTC}) PCI2.B7(~{INTB}) RN54.1 U5.3(1C3)
PCI_IRDY#: PCI0.B35(~{IRDY}) PCI1.B35(~{IRDY}) PCI2.B35(~{IRDY}) RN60.1 U13.142(IRDY#) U19.2(I1)
PCI_PAR: PCI0.A43(PAR) PCI1.A43(PAR) PCI2.A43(PAR) RN66.1 U13.119(PAR)
PCI_PERR#: PCI0.B40(~{PERR}) PCI1.B40(~{PERR}) PCI2.B40(~{PERR}) RN64.1 U13.140(PERR#)
PCI_RESET#: C142.2 IDE1.1(RESET) IDE2.1(RESET) PCI0.A15(~{RESET}) PCI1.A15(~{RESET}) PCI2.A15(~{RESET}) U19.16(I/O4)
PCI_SERR#: PCI0.B42(~{SERR}) PCI1.B42(~{SERR}) PCI2.B42(~{SERR}) RN65.1
PCI_STOP#: PCI0.A38(~{STOP}) PCI1.A38(~{STOP}) PCI2.A38(~{STOP}) RN63.1 U13.118(STOP#) U19.8(I7)
PCI_TRDY#: PCI0.A36(~{TRDY}) PCI1.A36(~{TRDY}) PCI2.A36(~{TRDY}) RN61.1 U13.117(TRDY#) U19.3(I2)
PCICLK1: PCI0.B16(CLK) PCI1.B16(CLK) R16.1
PCICLK2: PCI2.B16(CLK) R20.1
PCLK: CT2.3 R24.1 R60.1 U13.104(PCLK) U19.1(CLK)
POWERGOOD: C9.2 C140.2 D7.A K1.2 R55.2 U13.10(PWRGD)
RAS0#: RM16.1 U13.97(RAS0#)
RAS1#: RM15.1 U13.96(RAS1#)
RAS2#: RM14.1 U13.95(RAS2#)
RAS3#: RM13.1 U13.94(RAS3#)
RDY#: CPU1.12(RDY#) U13.15(RDY#)
ROMCS#: R10.1 U2.22(~{CS})
SA/HDD/0: RD1.1 U13.190(SA0/HDD0) U17.2(A0)
SA/HDD/1: RD2.1 U13.189(SA1/HDD1) U17.3(A1)
SA/HDD/2: RD3.1 U13.188(SA2/HDD2) U17.4(A2)
SA/HDD/3: RD4.1 U13.185(SA3/HDD3) U17.5(A3)
SA/HDD/4: RD5.1 U13.183(SA4/HDD4) U17.6(A4)
SA/HDD/5: RD6.1 U13.180(SA5/HDD5) U17.7(A5)
SA/HDD/6: RD7.1 U13.179(SA6/HDD6) U17.8(A6)
SA/HDD/7: RD8.1 U13.178(SA7/HDD7) U17.9(A7)
SA/HDD/8: RD9.1 U13.177(SA8/HDD8) U18.2(A0)
SA/HDD/9: RD10.1 U13.176(SA9/HDD9) U18.3(A1)
SA/HDD/10: RD11.1 U13.175(SA10/HDD10) U18.4(A2)
SA/HDD/11: RD12.1 U13.173(SA11/HDD11) U18.5(A3)
SA/HDD/12: RD13.1 U13.172(SA12/HDD12) U18.6(A4)
SA/HDD/13: RD14.1 U13.170(SA13/HDD13) U18.7(A5)
SA/HDD/14: RD15.1 U13.168(SA14/HDD14) U18.8(A6)
SA/HDD/15: RD16.1 U13.165(SA15/HDD15) U18.9(A7)
SMI#: CPU1.65(SMI#) R70.1
SMIACT#: CPU1.59(SMIACT#) R74.1
SPKOUT: R43.2 U13.1(SPKOUT)
SRESET: CPU1.58(SRESET) R47.1 U13.13(CPURST)
STC_RxD1: JM1.9 RU8.1 UM1.18(P3.0/RXD/CCP3_4/INT4)
STC_TxD1: JM1.10 RU7.1 UM1.19(P3.1/TXD/CCP2_4)
STPCLK#: CPU1.73(STPCLK#) U6.6(CLK(CPUSTPCLK)) U13.2(SLOWDWN#/STPCLK#)
TFT_BLK: TFT1.14(LED) UM1.38(P0.2/AD2/ADC10/RXD4)
TFT_CS: TFT1.19(~{CS}) UM1.40(P0.3/AD3/ADC11/TXD4)
TFT_DC: TFT1.17(RS) UM1.41(P0.4/AD4/ADC12/T3)
TFT_RST: TFT1.18(RST) UM1.42(P0.5/AD5/ADC13/T3CLKO)
TFT_SCL: TFT1.15(SCL) UM1.44(P0.7/AD7/T4CLKO)
TFT_SDA: TFT1.16(SDA) UM1.43(P0.6/AD6/ADC14/T4)
TOE#: CT1.20 U13.74(TOE#)
TWE#: CT1.25 R39.1 U13.73(TWE#)
V33: PCI0.A14(3.3Vaux(RSV)) PCI1.A14(3.3Vaux(RSV)) PCI2.A14(3.3Vaux(RSV)) RV1.2
VCC_CHIP: C10.1 C11.1 CC1.1 CC2.1 CC3.1 CC4.2 CC5.2 CC6.2 CC7.2 CC8.2 D3.K Q2.C(c) U13.18(VCC_1) U13.44(VCC_2) U13.75(VCC_3) U13.93(VCC_4) U13.129(VCC_5) U13.156(VCC_6) U13.186(VCC_7) U15.14
VCC_MCU: CU18.1 CU19.1 CU21.1 CU22.1 JM1.1 LU3.2 RU21.2 RU22.2 SW1.1 TFT1.9(5V) UM1.11(AVREF) UM1.14(VCC) UM2.1(A1) UM2.5(VCC) UM3.2(A0) UM3.5(VCC) UM4.5(VCC)
VCC_USB: CU16.1 CU17.1 DM3.K SW1.2 UM9.16(VCC) USB1.1(VBUS)
W/R#: CPU1.27(W/R#) RP213.1 U13.25(W/R#) U16.9(A7)
WB/WT#: CPU1.64(WB/WT#) R71.1
Net58_2: 58.2 C57.2 R17.2 U6.14(VCC(RC))
NetB1_2: B1.2 R51.1
NetBAT1_1: BAT1.1(+) R46.2
NetC63_2: C63.2 U6.2(X1) X1.2
NetC64_2: C64.2 U6.3(X2) X1.1
NetC66_2: C66.2 C67.2 L1.2 U6.9(VCC(LC))
NetC68_1: C68.1 U6.10(C)
NetC132_1: C132.1 X2.1
NetC132_2: C132.2 U15.4 U15.5
NetCN1_1: CN1.1 R2.2
NetCN1_2: CN1.2 R6.2
NetCN1_5: CN1.5 R5.2
NetCN2_2: CN2.2 RK1.2
NetCN2_3: CN2.3 RK2.2
NetCPU1_70: CPU1.70(CACHE#) R69.2
NetCU1_1: CU1.1 JU1.1(+) QM1.1(S) QM1.2(S) QM1.3(S) RU1.2
NetCU4_2: CU4.2 UM5.4(VOUT)
NetCU5_1: CU5.1 CU6.1 LU1.1 RU3.2 UM4.8(IN+) VR1.1 VR1.W
NetCU7_1: CU7.1 CU8.1 LU2.1 RU5.2 UM3.8(IN+) VR2.1 VR2.W
NetCU9_2: CU9.2 UM6.4(VOUT)
NetCU13_1: CU13.1 CU14.1 DM3.A UM8.3(+5V)
NetCU15_2: CU15.2 UM9.4(V3.3)
NetD3_A: D3.A R46.1
NetDU1_K: DU1.K LU1.2 UM5.0 UM5.3(VOUT)
NetDU2_K: DU2.K LU2.2 UM6.0 UM6.3(VOUT)
NetJ1_1: J1.1 R1.1
NetJ5_1: J5.1 U6.13(J6)
NetJ5_3: J5.3 U6.12(J5)
NetLHD1_1: LHD1.1 RL1.1
NetLHD2_1: LHD2.1 RL2.1
NetPCI0_A26: PCI0.A26(IDSEL) R118.2
NetPCI1_A26: PCI1.A26(IDSEL) R18.2
NetPCI2_A26: PCI2.A26(IDSEL) R19.2
NetQ1_3: Q1.3(B) Q5.3(K) R27.2
NetQ2_B: Q2.B(b) R42.1
NetQ3_B: Q3.B(b) R40.1 R41.2
NetQ3_C: Q3.C(c) R42.2
NetQ4_B: Q4.B(b) R43.1
NetQ4_C: Q4.C(c) R51.2
NetQ5_1: Q5.1(REF) R29.1 R31.2
NetQM1_4: QM1.4(G) RU1.1 S1.3(COMMON1) S1.6(NO2)
NetR16_2: R16.2 U7.9(2Y1)
NetR20_2: R20.2 U7.7(2Y2)
NetR24_2: R24.2 U7.3(2Y4)
NetR25_2: R25.2 U7.18(1Y1)
NetR26_2: R26.2 U7.16(1Y2)
NetR33_2: R33.2 U13.187(BALE)
NetR35_2: R35.2 U13.174(SYSCLK)
NetR36_2: R36.2 U13.194(MEMR#)
NetR37_2: R37.2 U13.196(MEMW#)
NetR44_1: R44.1 U15.2 U15.3
NetR44_2: R44.2 U15.1 X2.2
NetRP21_2: RP21.2 U13.161(SMEMR#)
NetRP22_2: RP22.2 U13.160(SMEMW#)
NetRP23_2: RP23.2 U13.163(IOR#)
NetRP24_2: RP24.2 U13.162(IOW#)
NetRU2_1: RU2.1 UM5.2(VOUT) VR1.2
NetRU6_1: RU6.1 UM6.2(VOUT) VR2.2
NetRU7_2: RU7.2 UM9.3(RxD)
NetRU8_2: RU8.2 UM9.2(TxD)
NetRU19_1: RU19.1 UM1.24(P3.6/INT2/WR_2/RXD_2/CMP-)
NetRU20_1: RU20.1 UM1.23(P3.5/T1/T0CLKO/ECI_4/SS_4/PWMFLT)

Not connected (* = marked no-connect by the designer): CN1 3; CPU1 3(INC) 4(PCHK#) 18(TCK) 26(HLDA) 30(BREQ) 40(PWT) 67(INC) 68(TDO) 90(DP3) 96(INC) 109(DP2) 125(DP1) 127(INC) 145(DP0) 167(TMS) 168(TDI) 194(UP#) 204(BLAST#) 206(PLOCK#); CT1 0 1 12 40 51; CT2 0; IDE1 21(DMARQ) 29(~{DMAACK}) 34(Passed_diagnostics); IDE2 21(DMARQ) 29(~{DMAACK}) 34(Passed_diagnostics); ISA1 B05(-5V); ISA2 B05(-5V); ISA3 B05(-5V); K1 3 4; M1 11(NC) 35(PQ3(NC)) 36(PQ1(NC)) 37(PQ2(NC)) 38(PQ4(NC)) 48(NC) 66(NC) 67(PD1) 68(PD2) 69(PD3) 70(PD4) 71(NC); M2 11(NC) 35(PQ3(NC)) 36(PQ1(NC)) 37(PQ2(NC)) 38(PQ4(NC)) 48(NC) 66(NC) 67(PD1) 68(PD2) 69(PD3) 70(PD4) 71(NC); M3 11(NC) 35(PQ3(NC)) 36(PQ1(NC)) 37(PQ2(NC)) 38(PQ4(NC)) 48(NC) 66(NC) 67(PD1) 68(PD2) 69(PD3) 70(PD4) 71(NC); M4 11(NC) 35(PQ3(NC)) 36(PQ1(NC)) 37(PQ2(NC)) 38(PQ4(NC)) 48(NC) 66(NC) 67(PD1) 68(PD2) 69(PD3) 70(PD4) 71(NC); P1 1(VO+); PCI0 A1(~{TRST}) A3(TMS) A4(TDI) A9(Reserved) A11(Reserved) A19(~{PME}) A40(SDONE) A41(SBO#) A60(~{REQ64}) B2(TCK) B4(TDO) B9(~{PRSTN1}) B10(Reserved) B11(~{PRST}N~{2}) B14(Reserved) B39(~{LOCK}) B60(~{ACK64}); PCI1 A1(~{TRST}) A3(TMS) A4(TDI) A9(Reserved) A11(Reserved) A19(~{PME}) A40(SDONE) A41(SBO#) A60(~{REQ64}) B2(TCK) B4(TDO) B9(~{PRSTN1}) B10(Reserved) B11(~{PRST}N~{2}) B14(Reserved) B39(~{LOCK}) B60(~{ACK64}); PCI2 A1(~{TRST}) A3(TMS) A4(TDI) A9(Reserved) A11(Reserved) A19(~{PME}) A40(SDONE) A41(SBO#) A60(~{REQ64}) B2(TCK) B4(TDO) B9(~{PRSTN1}) B10(Reserved) B11(~{PRST}N~{2}) B14(Reserved) B39(~{LOCK}) B60(~{ACK64}); S1 1(NO1) 4(NC2); SW1 3; TFT1 1(RST) 2(~{CS}) 3(RS) 4(SDA) 5(SCL) 6(3.3V) 7(LED) 8(GND) 12(NC) 13(NC); U7 5(2Y3) 12(1Y4) 14(1Y3); U15 8 10 12; U19 4(I3) 9(I8) 12(I/O8) 13(I/O7) 14(I/O6) 15(I/O5) 17(I/O3) 18(I/O2); UM9 7(Xi) 8(Xo) 9(CTS) 10(DST) 11(RI) 12(DCD#) 13(DTR) 14(RTS#) 15(R232); USB1 4(ID)

### Notes on the sheet
- (near CPU1) NC
- NONET
- (near M1) NC
- (near M2) NC
- (near M3) NC
- (near M4) NC
- (near D1) NONET
- NC
- R
- X
- (near U5) G\=1:Y=0
- G\=0:
- B A = 0 0 : Y=C0
- B A = 0 1 : Y=C1
- B A = 1 0 : Y=C2
- B A = 1 1 : Y=C3
- (near U19) NC
- (near Q3) NPN
- (near Q2) PNP
- Labels drawn without touching a wire or pin: GND
- (in symbol XL4015) Vin; SW; VC; FB

### Library data of the parts
58 C8 C9 C12 C57 C63 C64 C66-C68 C132 C140 C142 CC4-CC8 CU3-CU5 CU8-CU10 CU14-CU19 CU21-CU24 = CAP
CU1 CU2 CU6 CU7 CU11-CU13 = CAP1
D1 D7 DM3 DU1 DU2 = DIODE1
JU1 = DCIN: Connector
K1 = KEY4
KM1 KM2 = KEY
LU1-LU3 = L
Q2 = PNP
Q3 Q4 = NPN
QM1 = MOS-SO-8
R1-R3 R5 R6 R8 R10-R14 R16-R20 R22-R27 R29 R31 R33 R35-R49 R51 R55-R57 R59-R64 R67-R74 R100-R103 R105-R107 R118 RD1-RD34 RK1 RK2 RL1 RL2 RM1-RM20 RN51-RN82 RP21-RP24 RP51-RP54 RP61-RP64 RP71-RP74 RP212-RP214 RP221-RP224 RQ1-RQ12 RU1-RU8 RU19-RU22 RV1 = RES2
S1 = 双刀双柄开关
UM9 = CH340G
VR1 VR2 = VR
X1 X2 = CRYSTAL